# Altium project _OM-O2S Dev.Board.PrjPCB
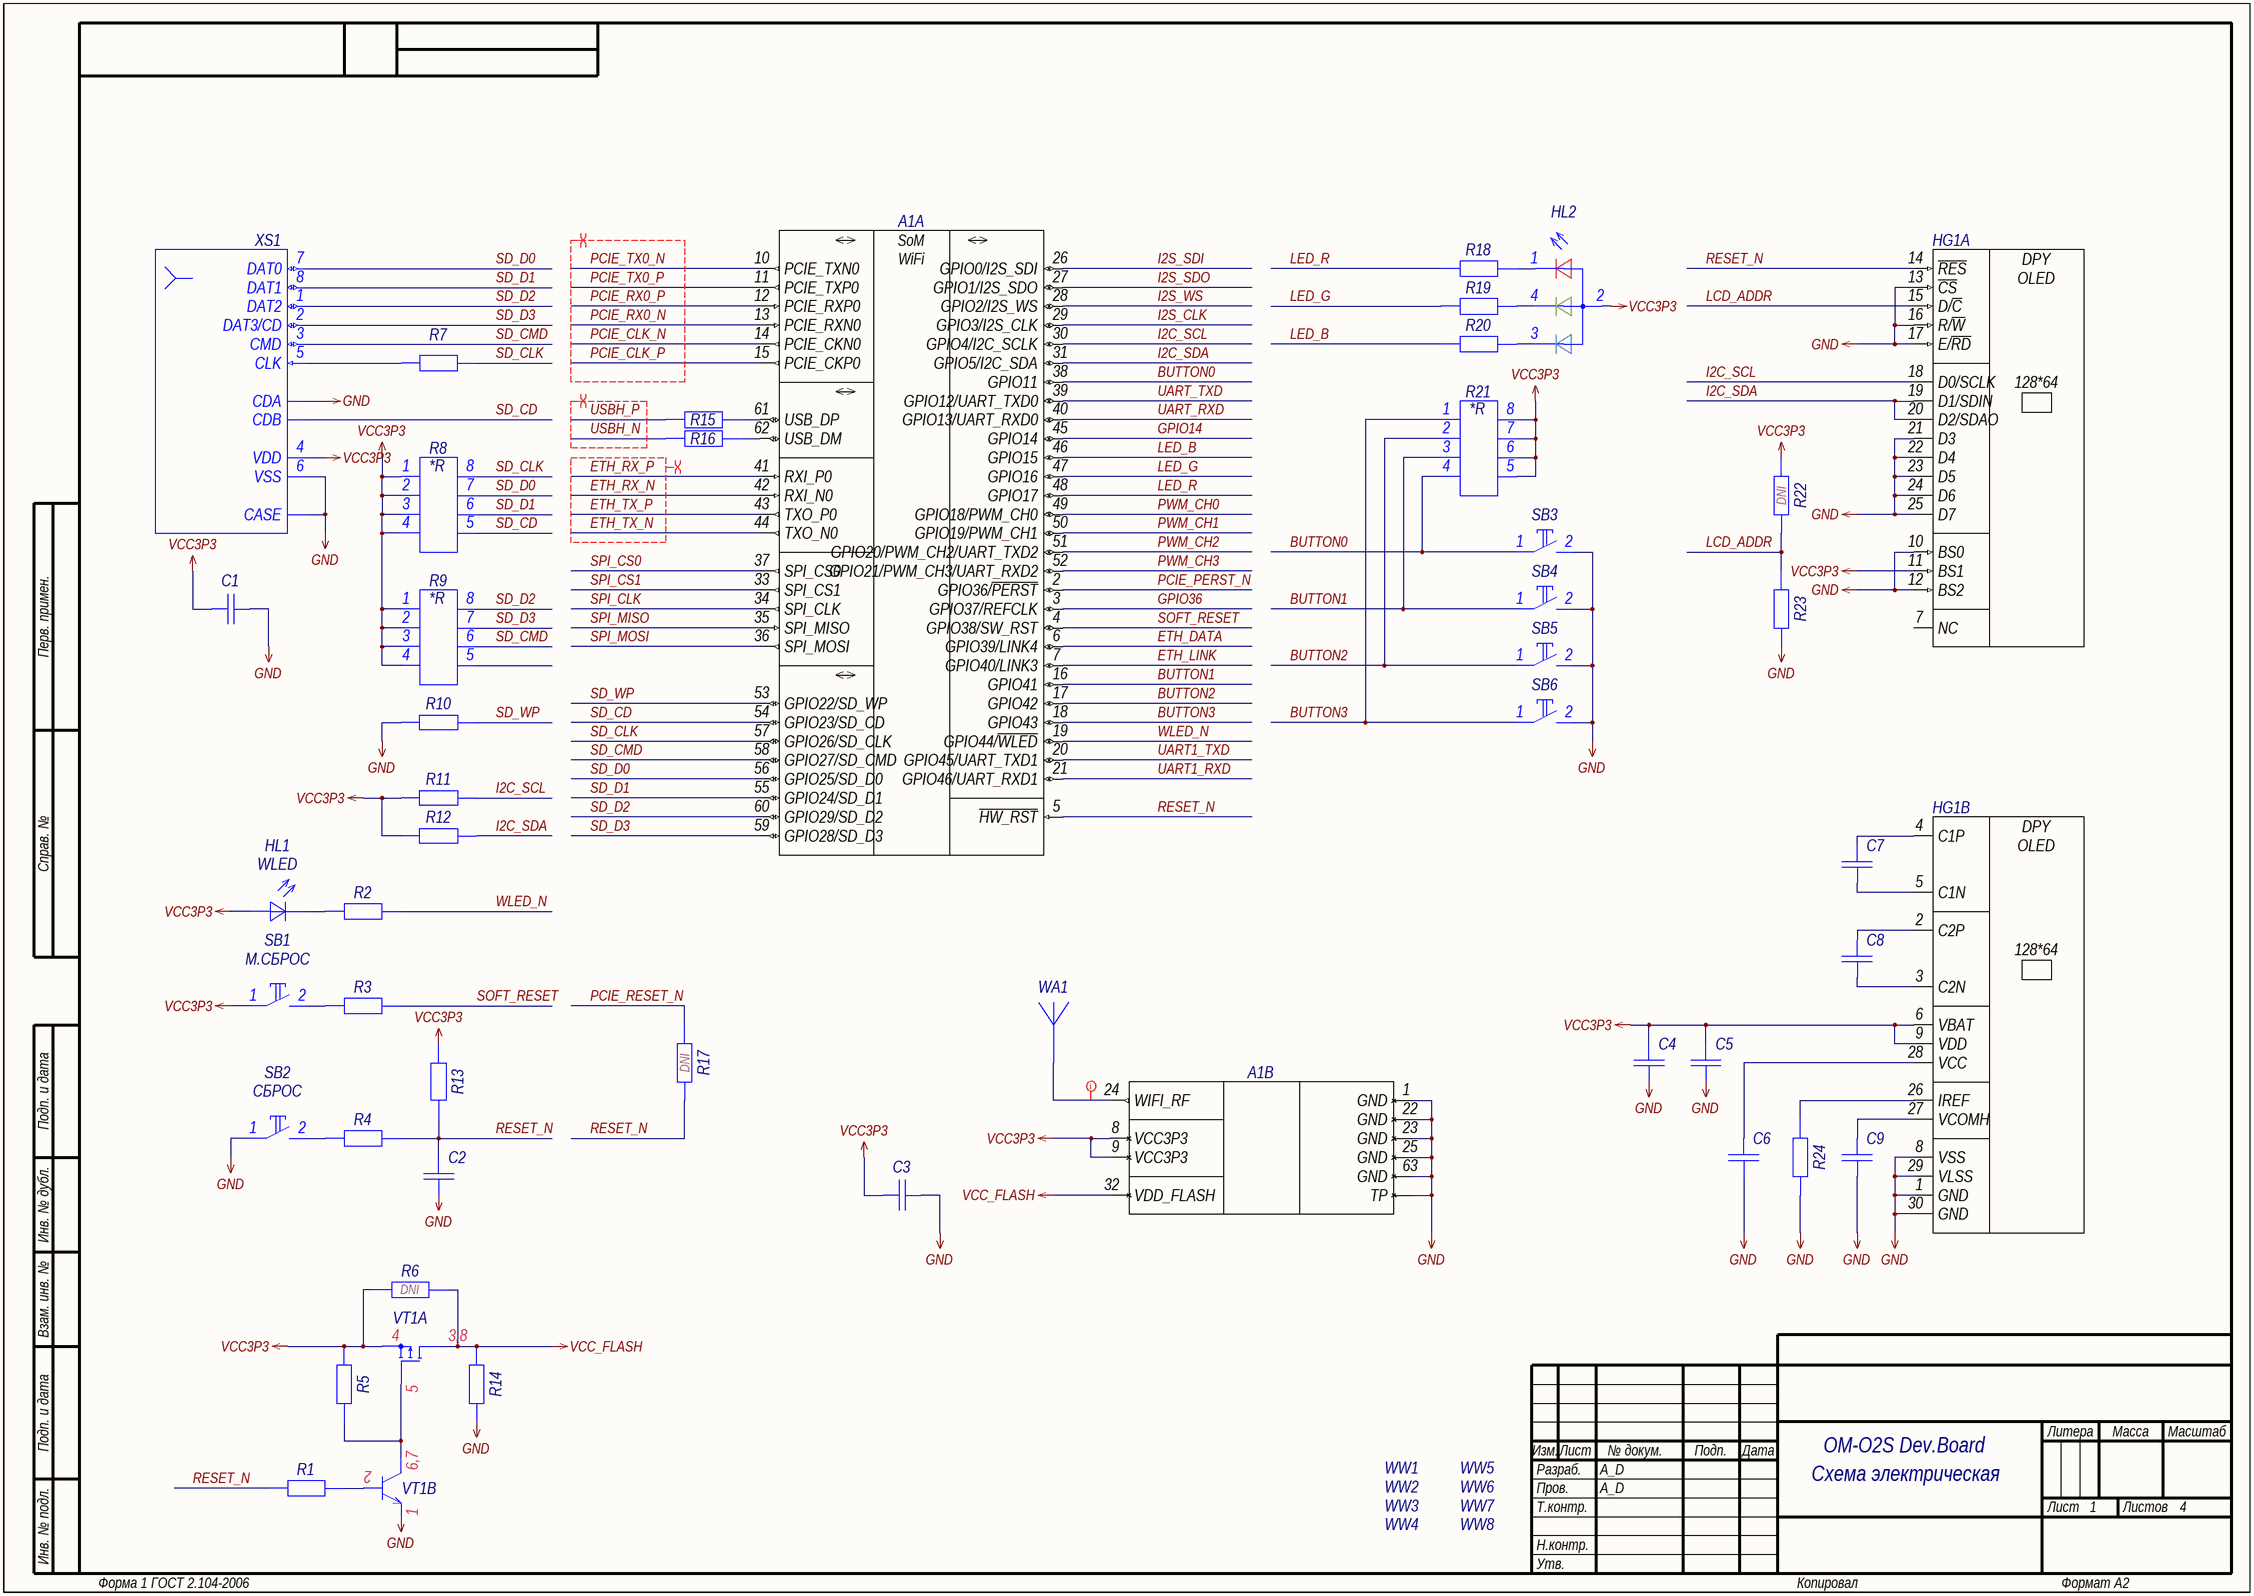
[diagram p0: 01_MAIN.SchDoc]
GlobalOrganizationName: A_D Electronics; GlobalProjectName: OM-O2S Dev.Board; GlobalProjectNumber: A_D.000000.001; GlobalProjectRevision: 1; PCB_ID: NA
4 sheets, 157 parts. Net scope: global (net labels, ports and power ports of the same name join across sheets).
Board file: BOARD.PcbDoc
Sheets:
  01_MAIN.SchDoc
  02_PCIE.SchDoc
  03_I2S.SchDoc
  04_Power.SchDoc

## Sheet 01_MAIN.SchDoc: =GlobalProjectName
size 594 x 420 mm; CheckedBy: A_D; Author: A_D; Organization: A_D Electronics; DocumentNumber: A_D.000000.001 Э3; Revision: 1; SheetNumber: 1; SheetTotal: 4; PageSetup: Record=PageOptions|CenterHorizontal=True|CenterVertical=True|PrintScale=0.70|XCorrection=1.00|YCorrection=1.00|PrintKind=2|BorderSize=5000000|LeftOffset=9000|BottomOffset=10100|Orientation=2|PaperLength=11176|PaperWidth=8636|Scale=100|PaperSource=259|PrintQuality=-3|MediaType=1|DitherType=10|PrintScaleMode=1|PaperKind=A3|PaperIndex=8; FirstApplication: A_D.000000.001; DocumentName: OM-O2S Dev.Board

### Parts
A1  OM-O2Sx  [OM-O2Sx]  (value not drawn)  (parts A,B of 2)
C1  Capacitor  [C0603_L]  (value not drawn)
C2  Capacitor  [C0603_L]  (value not drawn)
C3  Capacitor  [C0603_L]  (value not drawn)
C4  Capacitor  [C0603_L]  (value not drawn)
C5  Capacitor  [C0603_L]  (value not drawn)
C6  Capacitor  [C0603_L]  (value not drawn)
C7  Capacitor  [C0603_L]  (value not drawn)
C8  Capacitor  [C0603_L]  (value not drawn)
C9  Capacitor  [C0603_L]  (value not drawn)
HG1  UG-2864HSWEG01  [UG-2864HSWEG01]  (value not drawn)  (parts A,B of 2)
HL1  WLED  [LD0603_L]
HL2  USER LED  [FM-B1515RGBA-HG]  (value not drawn)
R1  Resistor  [R0603_L]  (value not drawn)
R2  Resistor  [R0603_L]  (value not drawn)
R3  Resistor  [R0603_L]  (value not drawn)
R4  Resistor  [R0603_L]  (value not drawn)
R5  Resistor  [R0603_L]  (value not drawn)
R6  Resistor  [R0603_L]  (value not drawn)  (no BOM)
R7  Resistor  [R0603_L]  (value not drawn)
R8  Resistor-4  [CAT16-x4]  (value not drawn)
R9  Resistor-4  [CAT16-x4]  (value not drawn)
R10  Resistor  [R0603_L]  (value not drawn)
R11  Resistor  [R0603_L]  (value not drawn)
R12  Resistor  [R0603_L]  (value not drawn)
R13  Resistor  [R0603_L]  (value not drawn)
R14  Resistor  [R0603_L]  (value not drawn)
R15  Resistor  [R0603_L]  (value not drawn)
R16  Resistor  [R0603_L]  (value not drawn)
R17  Resistor  [R0603_L]  (value not drawn)  (no BOM)
R18  Resistor  [R0603_L]  (value not drawn)
R19  Resistor  [R0603_L]  (value not drawn)
R20  Resistor  [R0603_L]  (value not drawn)
R21  Resistor-4  [CAT16-x4]  (value not drawn)
R22  Resistor  [R0603_L]  (value not drawn)  (no BOM)
R23  Resistor  [R0603_L]  (value not drawn)
R24  Resistor  [R0603_L]  (value not drawn)
SB1  М.СБРОС  [IT-1185AP]
SB2  СБРОС  [IT-1185AP]
SB3  (no value)  [IT-1185AP]
SB4  (no value)  [IT-1185AP]
SB5  (no value)  [IT-1185AP]
SB6  (no value)  [IT-1185AP]
VT1  PMC85XP  [SOT-1118-2M_065P200X200X065_N]  (value not drawn)  (parts A,B of 2)
WA1  Antenna_US_1p  [AN9520]  (value not drawn)
WW1  NoBody  [MH_M2.5]  (value not drawn)  (no BOM)
WW2  NoBody  [MH_M2.5]  (value not drawn)  (no BOM)
WW3  NoBody  [MH_M2.5]  (value not drawn)  (no BOM)
WW4  NoBody  [MH_M2.5]  (value not drawn)  (no BOM)
WW5  NoBody  [MH_M3.0]  (value not drawn)  (no BOM)
WW6  NoBody  [MH_M3.0]  (value not drawn)  (no BOM)
WW7  NoBody  [MH_M3.0]  (value not drawn)  (no BOM)
WW8  NoBody  [MH_M3.0]  (value not drawn)  (no BOM)
XS1  DM3AT-SF-PEJM5  [DM3AT-SF-PEJM5]  (value not drawn)

### Nets
GND: A1.1(GND) A1.22(GND) A1.23(GND) A1.25(GND) A1.63(GND) A1.TP C1.2 C2.1 C3.2 C4.1 C5.1 C6.1 C9.1 HG1.1(GND) HG1.8(VSS) HG1.10(BS0) HG1.12(BS2) HG1.13(~{CS}) HG1.16(R/~{W}) HG1.17(E/~{RD}) HG1.21(D3) HG1.22(D4) HG1.23(D5) HG1.24(D6) HG1.25(D7) HG1.29(VLSS) HG1.30(GND) R10.1 R14.1 R23.1 R24.1 SB2.1 SB3.2 SB4.2 SB5.2 SB6.2 VT1.1(Э) XS1.6(VSS) XS1.CASE XS1.CDA
VCC3P3: A1.8(VCC3P3) A1.9(VCC3P3) C1.1 C3.1 C4.2 C5.2 HG1.6(VBAT) HG1.9(VDD) HG1.11(BS1) HL1.1(А) HL2.2 R5.2 R6.2 R8.1 R8.2 R8.3 R8.4 R9.1 R9.2 R9.3 R9.4 R11.1 R12.1 R13.2 R21.5 R21.6 R21.7 R21.8 R22.2 SB1.1 VT1.4(S) XS1.4(VDD)
VCC_FLASH: A1.32(VDD_FLASH) R6.1 R14.2 VT1.3(D)
BUTTON0: A1.38(GPIO11) R21.4 SB3.1
BUTTON1: A1.16(GPIO41) R21.3 SB4.1
BUTTON2: A1.17(GPIO42) R21.2 SB5.1
BUTTON3: A1.18(GPIO43) R21.1 SB6.1
ETH_DATA: A1.6(GPIO39/LINK4)
ETH_LINK: A1.7(GPIO40/LINK3)
ETH_RX_N: A1.42(RXI_N0)
ETH_RX_P: A1.41(RXI_P0)
ETH_TX_N: A1.44(TXO_N0)
ETH_TX_P: A1.43(TXO_P0)
GPIO14: A1.45(GPIO14)
GPIO36: A1.3(GPIO37/REFCLK)
I2C_SCL: A1.30(GPIO4/I2C_SCLK) HG1.18(D0/SCLK) R11.2
I2C_SDA: A1.31(GPIO5/I2C_SDA) HG1.19(D1/SDIN) HG1.20(D2/SDAO) R12.2
I2S_CLK: A1.29(GPIO3/I2S_CLK)
I2S_SDI: A1.26(GPIO0/I2S_SDI)
I2S_SDO: A1.27(GPIO1/I2S_SDO)
I2S_WS: A1.28(GPIO2/I2S_WS)
LCD_ADDR: HG1.15(D/~{C}) R22.1 R23.2
LED_B: A1.46(GPIO15) R20.1
LED_G: A1.47(GPIO16) R19.1
LED_R: A1.48(GPIO17) R18.1
PCIE_CLK_N: A1.14(PCIE_CKN0)
PCIE_CLK_P: A1.15(PCIE_CKP0)
PCIE_PERST_N: A1.2(GPIO36/~{PERST})
PCIE_RESET_N: R17.1
PCIE_RX0_N: A1.13(PCIE_RXN0)
PCIE_RX0_P: A1.12(PCIE_RXP0)
PCIE_TX0_N: A1.10(PCIE_TXN0)
PCIE_TX0_P: A1.11(PCIE_TXP0)
PWM_CH0: A1.49(GPIO18/PWM_CH0)
PWM_CH1: A1.50(GPIO19/PWM_CH1)
PWM_CH2: A1.51(GPIO20/PWM_CH2/UART_TXD2)
PWM_CH3: A1.52(GPIO21/PWM_CH3/UART_RXD2)
RESET_N: A1.5(~{HW_RST}) C2.2 HG1.14(~{RES}) R1.1 R4.2 R13.1 R17.2
SD_CD: A1.54(GPIO23/SD_CD) R8.5 XS1.CDB
SD_CLK: A1.57(GPIO26/SD_CLK) R7.2 R8.8
SD_CMD: A1.58(GPIO27/SD_CMD) R9.6 XS1.3(CMD)
SD_D0: A1.56(GPIO25/SD_D0) R8.7 XS1.7(DAT0)
SD_D1: A1.55(GPIO24/SD_D1) R8.6 XS1.8(DAT1)
SD_D2: A1.60(GPIO29/SD_D2) R9.8 XS1.1(DAT2)
SD_D3: A1.59(GPIO28/SD_D3) R9.7 XS1.2(DAT3/CD)
SD_WP: A1.53(GPIO22/SD_WP) R10.2
SOFT_RESET: A1.4(GPIO38/SW_RST) R3.2
SPI_CLK: A1.34(SPI_CLK)
SPI_CS0: A1.37(SPI_CS0)
SPI_CS1: A1.33(SPI_CS1)
SPI_MISO: A1.35(SPI_MISO)
SPI_MOSI: A1.36(SPI_MOSI)
UART1_RXD: A1.21(GPIO46/UART_RXD1)
UART1_TXD: A1.20(GPIO45/UART_TXD1)
UART_RXD: A1.40(GPIO13/UART_RXD0)
UART_TXD: A1.39(GPIO12/UART_TXD0)
USBH_N: R16.1
USBH_P: R15.1
WLED_N: A1.19(GPIO44/~{WLED}) R2.2
NetA1_24: A1.24(WIFI_RF) WA1.1
NetA1_61: A1.61(USB_DP) R15.2
NetA1_62: A1.62(USB_DM) R16.2
NetC6_2: C6.2 HG1.28(VCC)
NetC7_1: C7.1 HG1.5(C1N)
NetC7_2: C7.2 HG1.4(C1P)
NetC8_1: C8.1 HG1.3(C2N)
NetC8_2: C8.2 HG1.2(C2P)
NetC9_2: C9.2 HG1.27(VCOMH)
NetHG1_26: HG1.26(IREF) R24.2
NetHL1_2: HL1.2(К) R2.1
NetHL2_1: HL2.1 R18.2
NetHL2_3: HL2.3 R20.2
NetHL2_4: HL2.4 R19.2
NetR1_2: R1.2 VT1.2(Б)
NetR3_1: R3.1 SB1.2
NetR4_1: R4.1 SB2.2
NetR5_1: R5.1 VT1.5(G) VT1.6(К)
NetR7_1: R7.1 XS1.5(CLK)

Not connected (* = marked no-connect by the designer): HG1 7(NC); R9 5

### Layout directives
net class RF; rule Clearance Constraint [Clearance = 0.3mm]: NetA1_24
differential pair; differential pair class PCIE_DiffPair; rule Matched Net Lengths [Tolerance = 1mm]: PCIE_CLK_N, PCIE_CLK_P, PCIE_RX0_N, PCIE_RX0_P, PCIE_TX0_N, PCIE_TX0_P
differential pair; differential pair class USB_DiffPair; rule Matched Net Lengths [Tolerance = 1mm]: USBH_N, USBH_P
differential pair; differential pair class ETH_DiffPair; rule Matched Net Lengths [Tolerance = 1mm]: ETH_RX_N, ETH_RX_P, ETH_TX_N, ETH_TX_P

### Notes on the sheet
- (near R22) DNI
- (near R17) DNI
- (near R6) DNI
- Схема электрическая
  принципиальная
- Перв. примен.
- Справ. №
- Подп. и дата
- Инв. № дубл.
- Взам. инв. №
- Разраб.
- Изм.
- Лист
- № докум.
- Подп.
- Дата
- Литера
- Масса
- Масштаб
- Пров.
- Т.контр.
- Листов
- Инв. № подл.
- Н.контр.
- Утв.
- Форма 1 ГОСТ 2.104-2006
- Копировал
- Формат А2
- (in symbol CAT16-103J4LF) *R
- (in symbol OM-O2SP, part A) SoM; WiFi
- (in symbol PMC85XP, part A) 3,8
- (in symbol PMC85XP, part B) 6,7
- (in symbol UG-2864HSWEG01, part A) DPY
- (in symbol UG-2864HSWEG01, part B) DPY

### Library data of the parts
A1 = OM-O2SP: Manufacturer: Onion; ID: 1; Supply Operation: +2.97...3.63V; Supply Current: 400mA; ROM/RAM: 32MB/128MB; Wireless Compatibility: Wi-Fi; Supported Interfaces: GPIO, I2C, I2S, SPI, UART, USB; I/O Lines: 42; Operation Frequency: 580MHz; Working Temperature Min: -10°С; Working Temperature Max: +55°С; Functional Analog: OM-O2S; Published: 06.03.2019; Publisher: Andrew Danich; Type: Модуль; Part Number: OM-O2SP; Value: OM-O2SP; Application Category: 1
C1 C3 = GRM188R61A106KE69D: Manufacturer: Murata; Type: Конденсатор; ID: 173; Value: 10uF; Voltage: 10V; Tolerance: ±10%; Dielectric Type: X5R; Application Category: 1; Working Temperature Min: -55°С; Working Temperature Max: +85°С; Published: 18.05.2010; Publisher: Andrew Danich; Part Number: GRM188R61A106KE69D; Footprint: 0603
C2 = GRM188R72A104KA35D: Manufacturer: Murata; Type: Конденсатор; ID: 232; Value: 0.1uF; Voltage: 100V; Tolerance: ±10%; Dielectric Type: X7R; Application Category: 1; Working Temperature Min: -55°С; Working Temperature Max: +125°С; Published: 18.05.2010; Publisher: Andrew Danich; Part Number: GRM188R72A104KA35D; Footprint: 0603
C4 C5 C7 C8 = GCM188R71E105KA64D: Manufacturer: Murata; Type: Конденсатор; ID: 134; Value: 1uF; Voltage: 25V; Tolerance: ±10%; Dielectric Type: X7R; Application Category: 1; Working Temperature Min: -55°С; Working Temperature Max: +85°С; Published: 18.05.2010; Publisher: Andrew Danich; Part Number: GCM188R71E105KA64D; Footprint: 0603
C6 = GRM188R61E225MA12D: Manufacturer: Murata; Type: Конденсатор; ID: 152; Value: 2.2uF; Voltage: 25V; Tolerance: ±20%; Dielectric Type: X5R; Application Category: 1; Working Temperature Min: -55°С; Working Temperature Max: +85°С; Published: 18.05.2010; Publisher: Andrew Danich; Part Number: GRM188R61E225MA12D; Footprint: 0603
C9 = GRT188C81E475KE13D: Manufacturer: Murata; Type: Конденсатор; ID: 175; Value: 4.7uF; Voltage: 25V; Tolerance: ±20%; Dielectric Type: X6S; Application Category: 1; Working Temperature Min: -55°С; Working Temperature Max: +105°С; Published: 18.05.2010; Publisher: Andrew Danich; Part Number: GRT188C81E475KE13D; Footprint: 0603
HG1 = UG-2864HSWEG01: Manufacturer: WiseChip Semiconductor; ID: 1; Supply Operation: +1.65…3.3V; Supply Current: 28.9mA; Resolution - Pixels: 128*64; Diagonal: 0.96; Touch Panel: No; Display Type: OLED; Working Temperature Min: -30°С; Working Temperature Max: +70°С; Published: 13.03.2019; Publisher: Andrew Danich; Type: Индикатор графический; Part Number: UG-2864HSWEG01; Value: UG-2864HSWEG01; Application Category: 1
HL1 = BL-LS0603DNB: Type: Индикатор единичный; ID: 12; Forward Voltage: 3.5V; Forward Current: 30mA; Power Dissipation: 78mW; Color: Blue; Leds: 1; Published: 03.12.2013; Publisher: Andrew Danich; Part Number: BL-LS0603DNB; Value: BL-LS0603DNB; Footprint: 0603; Application Category: 1
HL2 = FM-B1515RGBA-HG: Manufacturer: Foshan NationStar Optoelectronics; Type: Сборка индикаторная; ID: 36; Forward Voltage: 2.4/3.4/3.4V; Forward Current: 50/40/40mA; Power Dissipation: 48/68/68mW; Color: Red, Green, Blue; Leds: 3; Application Category: 1; Working Temperature Min: -30°С; Working Temperature Max: +85°С; Published: 17.03.2019; Publisher: Andrew Danich; Part Number: FM-B1515RGBA-HG; Value: FM-B1515RGBA-HG
R1 = RC0603JR-0722KL: Manufacturer: Yageo; ID: 32; Value: 22k; Limit Voltage: 50V; Tolerance: ±5%; Temperature Coefficient: 100ppm; Total Power Dissipation: 0.1W; Series Type: Thick-Film; Application Category: 1; Working Temperature Min: -55°С; Working Temperature Max: +155°С; Published: 24.03.2010; Publisher: Andrew Danich; Type: Резистор; Part Number: RC0603JR-0722KL; Footprint: 0603
R2 = RC0603JR-071KL: Manufacturer: Yageo; ID: 19; Value: 1k; Limit Voltage: 50V; Tolerance: ±5%; Temperature Coefficient: 100ppm; Total Power Dissipation: 0.1W; Series Type: Thick-Film; Application Category: 1; Working Temperature Min: -55°С; Working Temperature Max: +155°С; Functional Analog: CR0603-JW-102E; Published: 24.03.2010; Publisher: Andrew Danich; Type: Резистор; Part Number: RC0603JR-071KL; Footprint: 0603
R3 R14 = RC0603JR-073KL: Manufacturer: Yageo; ID: 52; Value: 3k; Limit Voltage: 50V; Tolerance: ±5%; Temperature Coefficient: 100ppm; Total Power Dissipation: 0.1W; Series Type: Thick-Film; Application Category: 1; Working Temperature Min: -55°С; Working Temperature Max: +155°С; Published: 24.03.2010; Publisher: Andrew Danich; Type: Резистор; Part Number: RC0603JR-073KL; Footprint: 0603
R4 R18-R20 = RC0603JR-07100R: Manufacturer: Yageo; ID: 10; Value: 100; Limit Voltage: 50V; Tolerance: ±5%; Temperature Coefficient: 100ppm; Total Power Dissipation: 0.1W; Series Type: Thick-Film; Application Category: 1; Working Temperature Min: -55°С; Working Temperature Max: +155°С; Functional Analog: CR0603-JW-101E; Published: 24.03.2010; Publisher: Andrew Danich; Type: Резистор; Part Number: RC0603JR-07100R; Footprint: 0603
R5 = RC0603JR-0710KL: Manufacturer: Yageo; ID: 12; Value: 10k; Limit Voltage: 50V; Tolerance: ±5%; Temperature Coefficient: 100ppm; Total Power Dissipation: 0.1W; Series Type: Thick-Film; Application Category: 1; Working Temperature Min: -55°С; Working Temperature Max: +155°С; Functional Analog: CR0603-JW-103E; Published: 24.03.2010; Publisher: Andrew Danich; Type: Резистор; Part Number: RC0603JR-0710KL; Footprint: 0603
R6 R17 R22 R23 = RC0603JR-070R: Manufacturer: Yageo; ID: 5; Value: 0; Limit Voltage: 50V; Tolerance: ±5%; Temperature Coefficient: 100ppm; Total Power Dissipation: 0.1W; Series Type: Thick-Film; Application Category: 1; Working Temperature Min: -55°С; Working Temperature Max: +155°С; Functional Analog: RC0603FR-070RL, CR0603-J/-000E; Published: 24.03.2010; Publisher: Andrew Danich; Type: Резистор; Part Number: RC0603JR-070R; Footprint: 0603
R7 = RC0603JR-0730RL: Manufacturer: Yageo; ID: 412; Value: 30; Limit Voltage: 50V; Tolerance: ±5%; Temperature Coefficient: 100ppm; Total Power Dissipation: 0.1W; Series Type: Thick-Film; Application Category: 1; Working Temperature Min: -55°С; Working Temperature Max: +155°С; Published: 24.03.2010; Publisher: Andrew Danich; Type: Резистор; Part Number: RC0603JR-0730RL; Footprint: 0603
R8 R9 R21 = CAT16-103J4LF: Manufacturer: Bourns; ID: 232; Value: 10k; Limit Voltage: 50V; Tolerance: ±5%; Temperature Coefficient: 200ppm; Total Power Dissipation: 0,062W; Series Type: Thick-Film; Application Category: 1; Working Temperature Min: -55°С; Working Temperature Max: +125°С; Functional Analog: TC164-JR-0710KL; Published: 15.07.2014; Publisher: Andrew Danich; Type: Набор резисторов; Part Number: CAT16-103J4LF
R10-R13 = RC0603JR-074K7L: Manufacturer: Yageo; ID: 56; Value: 4.7k; Limit Voltage: 50V; Tolerance: ±5%; Temperature Coefficient: 100ppm; Total Power Dissipation: 0.1W; Series Type: Thick-Film; Application Category: 1; Working Temperature Min: -55°С; Working Temperature Max: +155°С; Published: 24.03.2010; Publisher: Andrew Danich; Type: Резистор; Part Number: RC0603JR-074K7L; Footprint: 0603
R15 R16 = RC0603JR-0722RL: Manufacturer: Yageo; ID: 29; Value: 22; Limit Voltage: 50V; Tolerance: ±5%; Temperature Coefficient: 100ppm; Total Power Dissipation: 0.1W; Series Type: Thick-Film; Application Category: 1; Working Temperature Min: -55°С; Working Temperature Max: +155°С; Published: 24.03.2010; Publisher: Andrew Danich; Type: Резистор; Part Number: RC0603JR-0722RL; Footprint: 0603
R24 = RC0603JR-07910KL: Manufacturer: Yageo; ID: 88; Value: 910k; Limit Voltage: 50V; Tolerance: ±5%; Temperature Coefficient: 100ppm; Total Power Dissipation: 0.1W; Series Type: Thick-Film; Application Category: 1; Working Temperature Min: -55°С; Working Temperature Max: +155°С; Published: 24.03.2010; Publisher: Andrew Danich; Type: Резистор; Part Number: RC0603JR-07910KL; Footprint: 0603
SB1-SB6 = IT-1185AP: ID: 36; Limit Current: 50mA; Resistance: 0.1ohm; Isolator Resistance: 100meg; Backlight: NO; Number of Contacts: 2; Application Category: 1; Published: 17.04.2014; Publisher: Andrew Danich; Type: Переключатель; Part Number: IT-1185AP; Value: IT-1185AP; Height: 5mm
VT1 = PMC85XP: Manufacturer: NXP Semiconductors; Type: Сборка транзисторная; ID: 33; D-S Voltage: -30V; Drain Current: -3.4A; D-S On-Resistance: 110momh; Gate Capacitance: 680pF; Total Power Dissipation: 1.17W; Gate Threshold Voltage: -1.2V; Application Category: 1; Working Temperature Min: -55°С; Working Temperature Max: +150°С; Published: 13.03.2017; Publisher: Andrew Danich; Part Number: PMC85XP; Value: PMC85XP; Functional Analog: -
WA1 = AN9520: Manufacturer: RainSun; ID: 1; Value: AN9520; Center Frequency: 2.45GHz; Peak Gain: 1.5dBi; VSWR: 2.0; Input Impedance: 50ohm; Power Handling: 3W; Azimuth Beamwidth: Omni‐directional; Bandwidth: Linear; Working Temperature Min: -40°С; Working Temperature Max: +85°С; Published: 15.01.2015; Type: Антенна; Publisher: Andrew Danich; Part Number: AN9520; Application Category: 1
WW1-WW8 = MOUNTINGHOLE: ID: 1; Published: 24.03.2015; Publisher: Andrew Danich; Type: Лепесток; Part Number: MOUNTINGHOLE; Value: MOUNTINGHOLE
XS1 = DM3AT-SF-PEJM5: Manufacturer: Hirose Connector; ID: 5; Limit Voltage: 125V; Style: Push-Push; Connector Type: microSD Card; Interface: SPI\SDIO; Pitch: 1.1mm; Application Category: 1; Working Temperature Min: -25°С; Working Temperature Max: +85°С; Value: DM3AT-SF-PEJM5; Published: 14.03.2019; Publisher: Andrew Danich; Type: Розетка; Part Number: DM3AT-SF-PEJM5; Pins: 10

## Sheet 02_PCIE.SchDoc: =GlobalProjectName
size 594 x 420 mm; CheckedBy: A_D; Author: A_D; Organization: A_D Electronics; DocumentNumber: A_D.000000.001 Э3; Revision: 1; SheetNumber: 2; SheetTotal: 4; PageSetup: Record=PageOptions|CenterHorizontal=True|CenterVertical=True|PrintScale=0.70|XCorrection=1.00|YCorrection=1.00|PrintKind=2|BorderSize=5000000|LeftOffset=9000|BottomOffset=10100|Orientation=2|PaperLength=11176|PaperWidth=8636|Scale=100|PaperSource=259|PrintQuality=-3|MediaType=1|DitherType=10|PrintScaleMode=1|PaperKind=A3|PaperIndex=8; FirstApplication: A_D.000000.001; DocumentName: OM-O2S Dev.Board
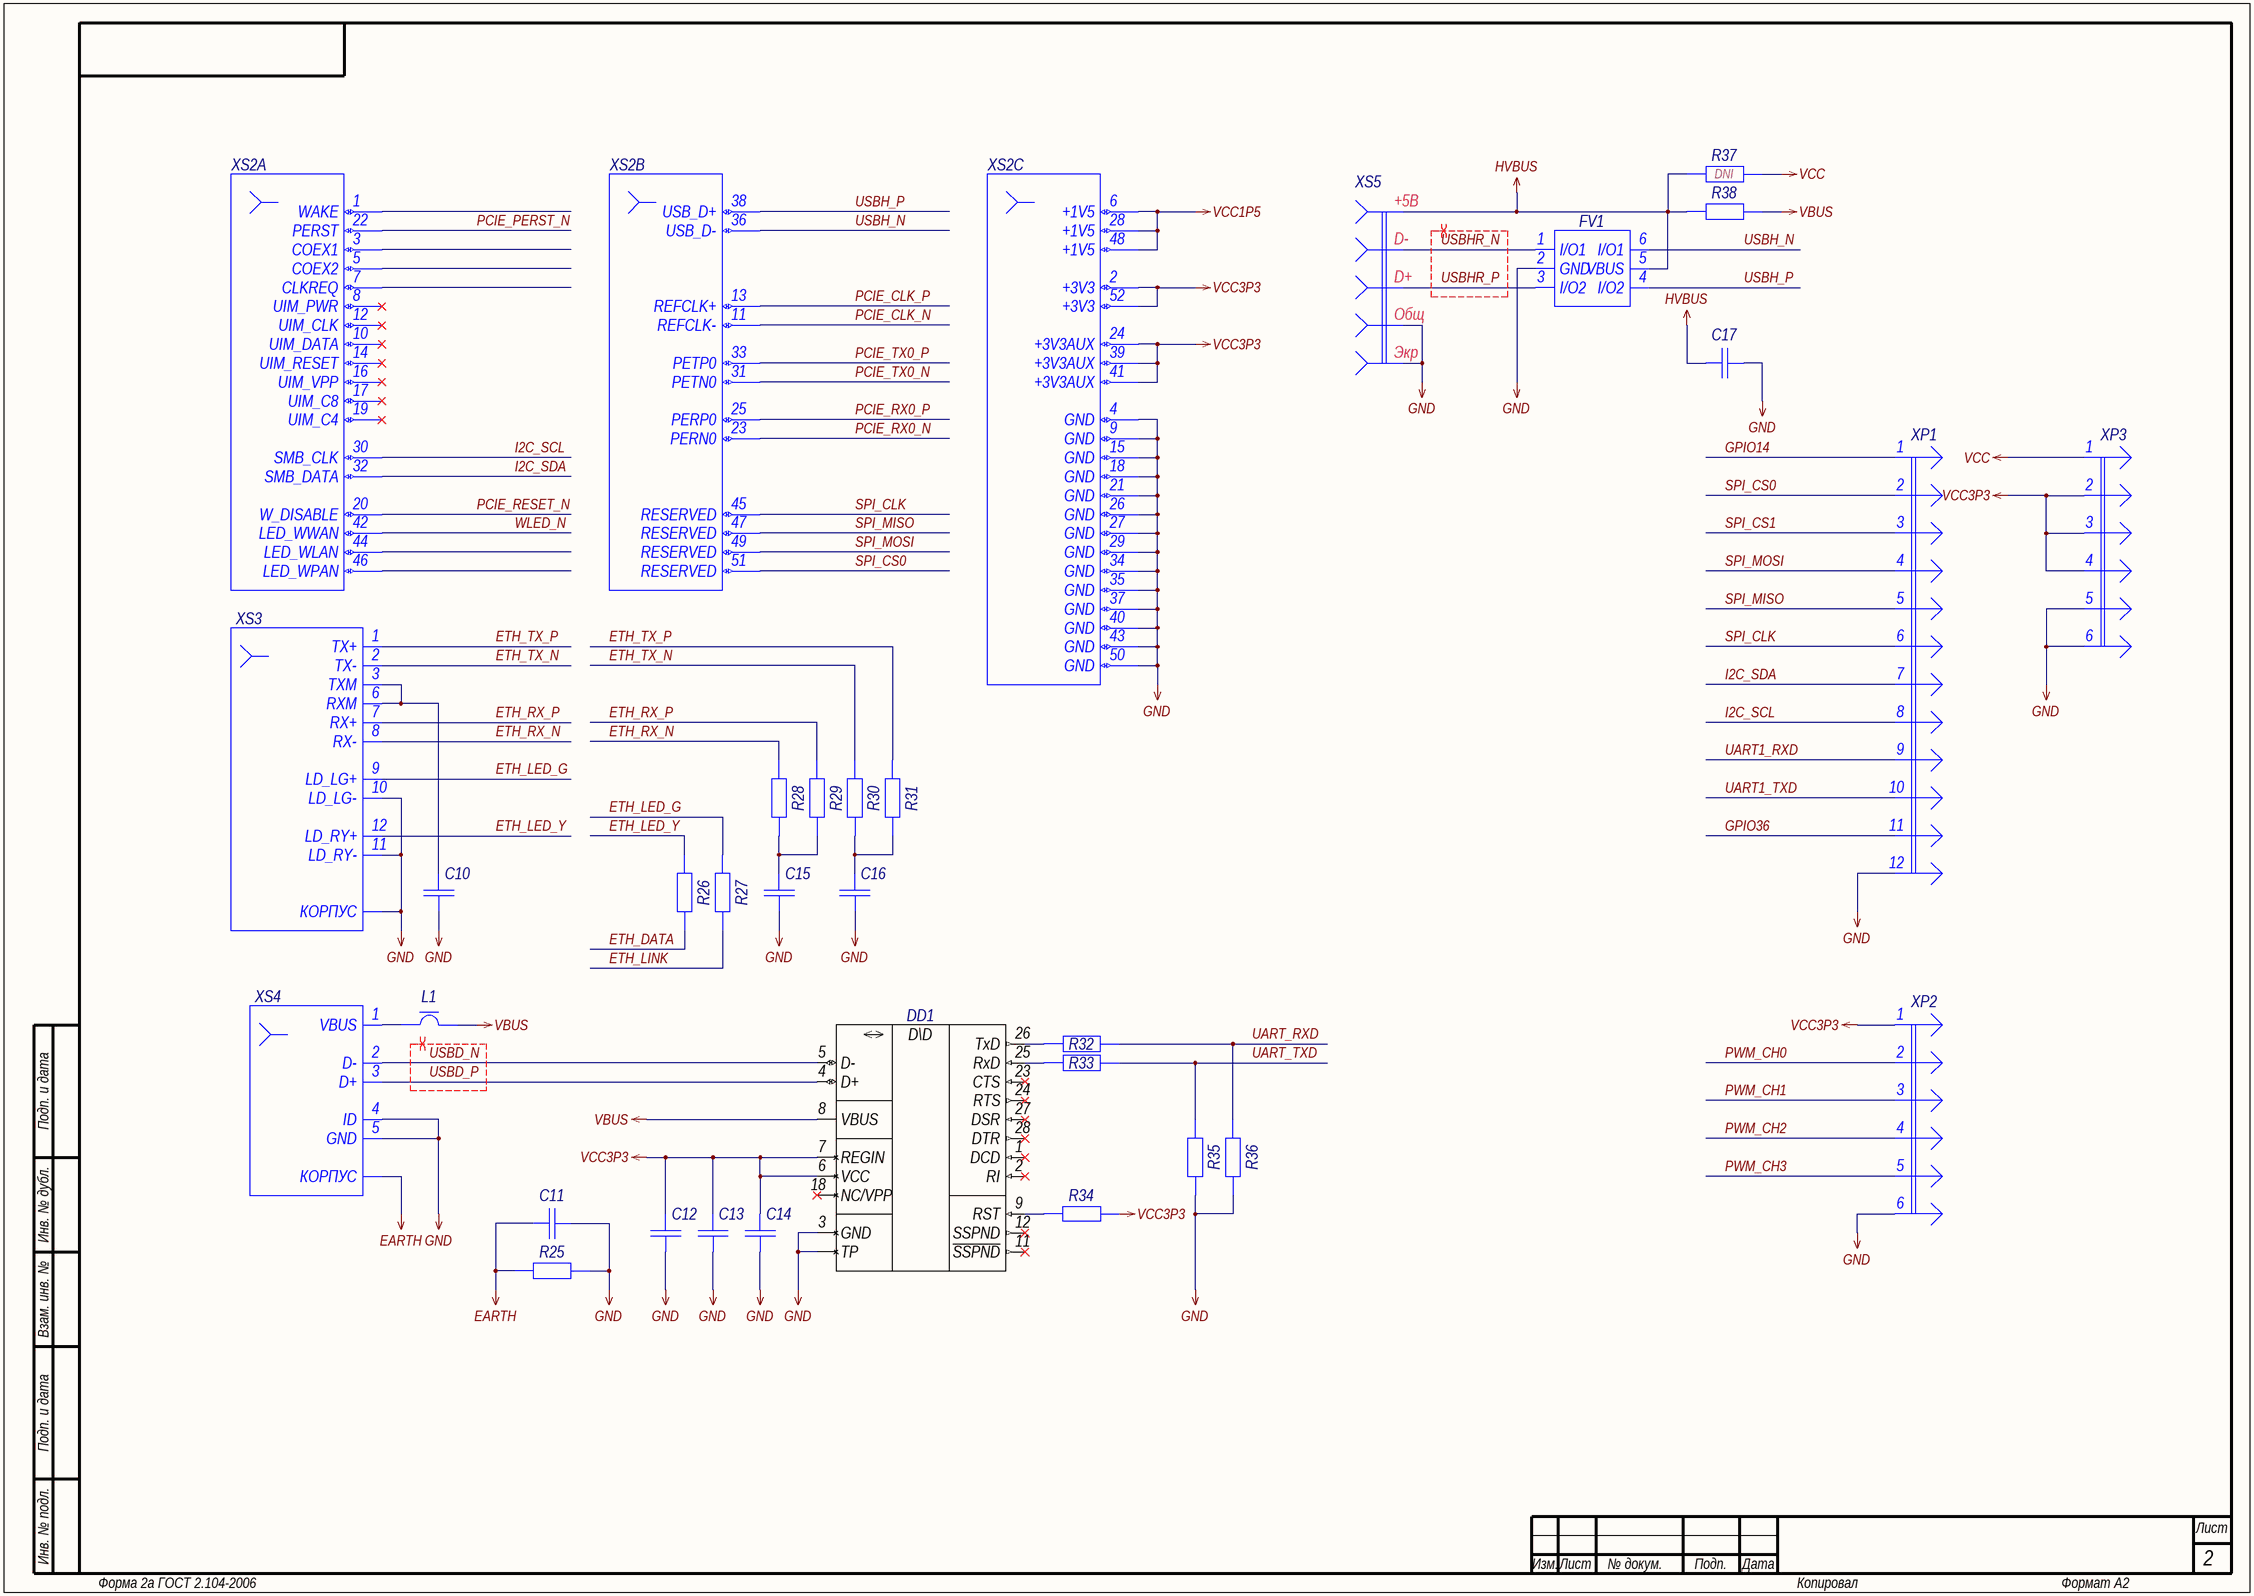
[diagram p1: 02_PCIE.SchDoc]

### Parts
C10  Capacitor  [C0603_L]  (value not drawn)
C11  Capacitor  [C0603_L]  (value not drawn)
C12  Capacitor  [C0603_L]  (value not drawn)
C13  Capacitor  [C0603_L]  (value not drawn)
C14  Capacitor  [C0603_L]  (value not drawn)
C15  Capacitor  [C0603_L]  (value not drawn)
C16  Capacitor  [C0603_L]  (value not drawn)
C17  Capacitor  [C0603_L]  (value not drawn)
DD1  CP2102_9  [QFN-28_050P500X500X100_N]  (value not drawn)
FV1  USBLC6-2SC6  [SOT-23-6_095P290X160X145_N]  (value not drawn)
L1  FerriteBead  [L0805_L]  (value not drawn)
R25  Resistor  [R0603_L]  (value not drawn)
R26  Resistor  [R0603_L]  (value not drawn)
R27  Resistor  [R0603_L]  (value not drawn)
R28  Resistor  [R0603_L]  (value not drawn)
R29  Resistor  [R0603_L]  (value not drawn)
R30  Resistor  [R0603_L]  (value not drawn)
R31  Resistor  [R0603_L]  (value not drawn)
R32  Resistor  [R0603_L]  (value not drawn)
R33  Resistor  [R0603_L]  (value not drawn)
R34  Resistor  [R0603_L]  (value not drawn)
R35  Resistor  [R0603_L]  (value not drawn)
R36  Resistor  [R0603_L]  (value not drawn)
R37  Resistor  [R0603_L]  (value not drawn)  (no BOM)
R38  Resistor  [R0603_L]  (value not drawn)
XP1  IO  [PLS-12]  (value not drawn)
XP2  POWER  [PLS-6]  (value not drawn)
XP3  POWER  [PLS-6]  (value not drawn)
XS2  Text  [2041119-2]  (value not drawn)  (parts A,B,C of 3)  (no BOM)
XS3  ETH  [SK02-111006NL]  (value not drawn)
XS4  Text  [A01SB141B1-067]  (value not drawn)
XS5  Text  [DS1095]  (value not drawn)

### Nets
EARTH: C11.2 R25.1 XS4.SHELL(КОРПУС)
GND: C10.1 C11.1 C12.1 C13.1 C14.1 C15.1 C16.1 C17.2 DD1.3(GND) DD1.TP FV1.2(GND) R25.2 R35.1 R36.1 XP1.12 XP2.6 XP3.5 XP3.6 XS2.4(GND) XS2.9(GND) XS2.15(GND) XS2.18(GND) XS2.21(GND) XS2.26(GND) XS2.27(GND) XS2.29(GND) XS2.34(GND) XS2.35(GND) XS2.37(GND) XS2.40(GND) XS2.43(GND) XS2.50(GND) XS3.10(LD_LG-) XS3.11(LD_RY-) XS3.CASE(КОРПУС) XS4.4(ID) XS4.5(GND) XS5.4 XS5.5
HVBUS: C17.1 FV1.5(VBUS) R37.1 R38.1 XS5.1
VBUS: DD1.8(VBUS) L1.2 R38.2
VCC: R37.2 XP3.1
VCC1P5: XS2.6(+1V5) XS2.28(+1V5) XS2.48(+1V5)
VCC3P3: C12.2 C13.2 C14.2 DD1.6(VCC) DD1.7(REGIN) R34.1 XP2.1 XP3.2 XP3.3 XP3.4 XS2.2(+3V3) XS2.24(+3V3AUX) XS2.39(+3V3AUX) XS2.41(+3V3AUX) XS2.52(+3V3)
ETH_DATA: R26.1
ETH_LED_G: R27.2 XS3.9(LD_LG+)
ETH_LED_Y: R26.2 XS3.12(LD_RY+)
ETH_LINK: R27.1
ETH_RX_N: R28.2 XS3.8(RX-)
ETH_RX_P: R29.2 XS3.7(RX+)
ETH_TX_N: R30.2 XS3.2(TX-)
ETH_TX_P: R31.2 XS3.1(TX+)
GPIO14: XP1.1
GPIO36: XP1.11
I2C_SCL: XP1.8 XS2.30(SMB_CLK)
I2C_SDA: XP1.7 XS2.32(SMB_DATA)
PCIE_CLK_N: XS2.11(REFCLK-)
PCIE_CLK_P: XS2.13(REFCLK+)
PCIE_PERST_N: XS2.22(PERST)
PCIE_RESET_N: XS2.20(W_DISABLE)
PCIE_RX0_N: XS2.23(PERN0)
PCIE_RX0_P: XS2.25(PERP0)
PCIE_TX0_N: XS2.31(PETN0)
PCIE_TX0_P: XS2.33(PETP0)
PWM_CH0: XP2.2
PWM_CH1: XP2.3
PWM_CH2: XP2.4
PWM_CH3: XP2.5
SPI_CLK: XP1.6 XS2.45(RESERVED)
SPI_CS0: XP1.2 XS2.51(RESERVED)
SPI_CS1: XP1.3
SPI_MISO: XP1.5 XS2.47(RESERVED)
SPI_MOSI: XP1.4 XS2.49(RESERVED)
UART1_RXD: XP1.9
UART1_TXD: XP1.10
UART_RXD: R32.2 R36.2
UART_TXD: R33.2 R35.2
USBD_N: DD1.5(D-) XS4.2(D-)
USBD_P: DD1.4(D+) XS4.3(D+)
USBH_N: FV1.6(I/O1) XS2.36(USB_D-)
USBH_P: FV1.4(I/O2) XS2.38(USB_D+)
USBHR_N: FV1.1(I/O1) XS5.2
USBHR_P: FV1.3(I/O2) XS5.3
WLED_N: XS2.42(LED_WWAN)
NetC10_2: C10.2 XS3.3(TXM) XS3.6(RXM)
NetC15_2: C15.2 R28.1 R29.1
NetC16_2: C16.2 R30.1 R31.1
NetDD1_9: DD1.9(RST) R34.2
NetDD1_25: DD1.25(RxD) R33.1
NetDD1_26: DD1.26(TxD) R32.1
NetL1_1: L1.1 XS4.1(VBUS)

Not connected (* = marked no-connect by the designer): DD1 1(DCD)* 2(RI)* 11(~{SSPND})* 12(SSPND)* 18(NC/VPP)* 23(CTS)* 24(RTS)* 27(DSR)* 28(DTR)*; XS2 1(WAKE) 3(COEX1) 5(COEX2) 7(CLKREQ) 8(UIM_PWR)* 10(UIM_DATA)* 12(UIM_CLK)* 14(UIM_RESET)* 16(UIM_VPP)* 17(UIM_C8)* 19(UIM_C4)* 44(LED_WLAN) 46(LED_WPAN)

### Layout directives
differential pair; differential pair class USB_DiffPair; rule Matched Net Lengths [Tolerance = 1mm]: USBD_N, USBD_P, USBHR_N, USBHR_P

### Notes on the sheet
- (near R37) DNI
- Подп. и дата
- Инв. № дубл.
- Взам. инв. №
- Инв. № подл.
- Изм.
- Лист
- № докум.
- Подп.
- Дата
- Форма 2а ГОСТ 2.104-2006
- Копировал
- Формат А2
- (in symbol CP2102-GM) D\D
- (in symbol DS1095-B-R) +5В; D-; D+; Общ; Экр

### Library data of the parts
C10 C11 C13-C16 = GRM188R72A104KA35D: as C2 on sheet 01_MAIN; Published: 18.05.2010; Publisher: Andrew Danich; Part Number: GRM188R72A104KA35D; Footprint: 0603
  C11: ClassName: DirectConnect
C12 = GCM188R71E105KA64D: as C4 on sheet 01_MAIN; Published: 18.05.2010; Publisher: Andrew Danich; Part Number: GCM188R71E105KA64D; Footprint: 0603
C17 = GRM188R61A106KE69D: as C1 on sheet 01_MAIN; Published: 18.05.2010; Publisher: Andrew Danich; Part Number: GRM188R61A106KE69D; Footprint: 0603
DD1 = CP2102-GM: Single Chip USB to UART Bridge; Manufacturer: Silicon Labs; ID: 4; Supply Operation: +3.3V; Supply Current: 13.7mA; USB Type Support: USB 2.0; USB Speed Support: 12 Mb/s; OTG Support: No; Channels: 1; Working Temperature Min: -40°C; Working Temperature Max: +85°C; Published: 03.08.2015; Publisher: Andrew Danich; Type: Микросхема; Part Number: CP2102-GM; Value: CP2102-GM; Input Interface: UART; Application Category: 1; Functional Analog: -
FV1 = USBLC6-2SC6: Manufacturer: STMicroelectronics; ID: 11; Breakdown Voltage: 6V; Reverse Stand Off Voltage: 17V; Forward Voltage: 0.95V; Peak Forward Current: 5A; Junction Capacitance: 2.5pF; Directional: Bidirectional; Application Category: 1; Working Temperature Min: -40°С; Working Temperature Max: +125°С; Published: 21.02.2017; Publisher: Andrew Danich; Type: Супрессор; Part Number: USBLC6-2SC6; Value: USBLC6-2SC6; Functional Analog: -
L1 = BLM21PG331SN1: Manufacturer: Murata; Type: Дроссель; ID: 2; Rated Current: 1.5A; Impedance at 100Mhz: 330ohm; Tolerance: ±25%; DC Resistance: 0.07ohm; Inductor Type: EMIFIL; Application Category: 1; Working Temperature Min: -55°С; Working Temperature Max: +125°С; Published: 14.11.2014; Publisher: Andrew Danich; Part Number: BLM21PG331SN1; Value: BLM21PG331SN1; Footprint: 0805; ClassName: DirectConnect
R25 = RC0603JR-07100KL: Manufacturer: Yageo; ID: 11; Value: 100k; Limit Voltage: 50V; Tolerance: ±5%; Temperature Coefficient: 100ppm; Total Power Dissipation: 0.1W; Series Type: Thick-Film; Application Category: 1; Working Temperature Min: -55°С; Working Temperature Max: +155°С; Functional Analog: CR0603-JW-104E; Published: 24.03.2010; Publisher: Andrew Danich; Type: Резистор; Part Number: RC0603JR-07100KL; Footprint: 0603; ClassName: DirectConnect
R26 R27 = RC0603JR-07330RL: Manufacturer: Yageo; ID: 313; Value: 330; Limit Voltage: 50V; Tolerance: ±5%; Temperature Coefficient: 100ppm; Total Power Dissipation: 0.1W; Series Type: Thick-Film; Application Category: 1; Working Temperature Min: -55°С; Working Temperature Max: +155°С; Functional Analog: CR0603-JW-331E; Published: 24.03.2010; Publisher: Andrew Danich; Type: Резистор; Part Number: RC0603JR-07330RL; Footprint: 0603
R28-R31 = RC0603FR-0749R9L: Manufacturer: Yageo; ID: 249; Value: 49.9; Limit Voltage: 50V; Tolerance: ±1%; Temperature Coefficient: 100ppm; Total Power Dissipation: 0.1W; Series Type: Thick-Film; Application Category: 1; Working Temperature Min: -55°С; Working Temperature Max: +155°С; Functional Analog: CR0603-FX-49R9E; Published: 24.03.2010; Publisher: Andrew Danich; Type: Резистор; Part Number: RC0603FR-0749R9L; Footprint: 0603
R32 R33 = RC0603JR-071KL: as R2 on sheet 01_MAIN; Published: 24.03.2010; Publisher: Andrew Danich; Type: Резистор; Part Number: RC0603JR-071KL; Footprint: 0603
R34 = RC0603JR-074K7L: as R10 on sheet 01_MAIN; Published: 24.03.2010; Publisher: Andrew Danich; Type: Резистор; Part Number: RC0603JR-074K7L; Footprint: 0603
R35 R36 = RC0603JR-073KL: as R3 on sheet 01_MAIN; Published: 24.03.2010; Publisher: Andrew Danich; Type: Резистор; Part Number: RC0603JR-073KL; Footprint: 0603
R37 R38 = RC0603JR-070R: as R6 on sheet 01_MAIN; Published: 24.03.2010; Publisher: Andrew Danich; Type: Резистор; Part Number: RC0603JR-070R; Footprint: 0603
XP1 = PLS-12: Value: PLS-12; ID: 10; Limit Voltage: 250V; Limit Current: 3A; Connector Type: Male; Resistance: 15momh; Surface Finish: Gold; Pitch: 2.54mm; Application Category: 1; Published: 07.03.2013; Publisher: Andrew Danich; Type: Вилка; Part Number: PLS-12; Pins: 12
XP2 XP3 = PLS-6: Value: PLS-6; ID: 5; Limit Voltage: 250V; Limit Current: 3A; Connector Type: Male; Resistance: 15momh; Surface Finish: Gold; Pitch: 2.54mm; Application Category: 1; Published: 07.03.2013; Publisher: Andrew Danich; Type: Вилка; Part Number: PLS-6; Pins: 6
XS2 = 2041119-2: Manufacturer: TE Connectivity; ID: 2; Connector Type: Card Edge; Surface Finish: Gold; Pitch: 0.8mm; Application Category: 1; Published: 06.03.2019; Publisher: Andrew Danich; Type: Розетка; Part Number: 2041119-2; Value: 2041119-2; Pins: 52
XS3 = SK02-111006NL: Manufacturer: Sanken Electric Co., Ltd; ID: 18; Limit Voltage: 125V; Limit Current: 1.5A; Connector Type: Female; Interface: Ethernet/Int.Trans.; Max Data Rate: 10/100Mbs; Application Category: 1; Working Temperature Min: -40°С; Working Temperature Max: +70°С; Value: SK02-111006NL; Published: 08.09.2014; Publisher: Andrew Danich; Type: Розетка; Part Number: SK02-111006NL; Pins: 12; Mount Type: Through hole; Functional Analog: -
XS4 = A01SB141B1-067: Manufacturer: Jing Extension of the Electronic Co; ID: 37; Limit Voltage: 30V; Limit Current: 1A; Connector Type: Female; Interface: USB 2.0; Max Data Rate: 480 mbps; Application Category: 1; Published: 17.09.2018; Publisher: Andrew Danich; Type: Розетка; Part Number: A01SB141B1-067; Value: A01SB141B1-067; Pins: 5; Mount Type: Surface; ClassName: DirectConnect
XS5 = DS1095-B-R: Manufacturer: Connfly Electronic Co., Ltd; ID: 19; Limit Voltage: 30V; Limit Current: 1.5A; Connector Type: Female; Interface: USB 2.0; Max Data Rate: 480 mbps; Application Category: 1; Value: DS1095-B-R; Published: 07.03.2013; Publisher: Andrew Danich; Type: Розетка; Part Number: DS1095-B-R; Pins: 6; Mount Type: Through hole

## Sheet 03_I2S.SchDoc: =GlobalProjectName
size 594 x 420 mm; CheckedBy: A_D; Author: A_D; Organization: A_D Electronics; DocumentNumber: A_D.000000.001 Э3; Revision: 1; SheetNumber: 3; SheetTotal: 4; PageSetup: Record=PageOptions|CenterHorizontal=True|CenterVertical=True|PrintScale=0.70|XCorrection=1.00|YCorrection=1.00|PrintKind=2|BorderSize=5000000|LeftOffset=9000|BottomOffset=10100|Orientation=2|PaperLength=11176|PaperWidth=8636|Scale=100|PaperSource=259|PrintQuality=-3|MediaType=1|DitherType=10|PrintScaleMode=1|PaperKind=A3|PaperIndex=8; FirstApplication: A_D.000000.001; DocumentName: OM-O2S Dev.Board
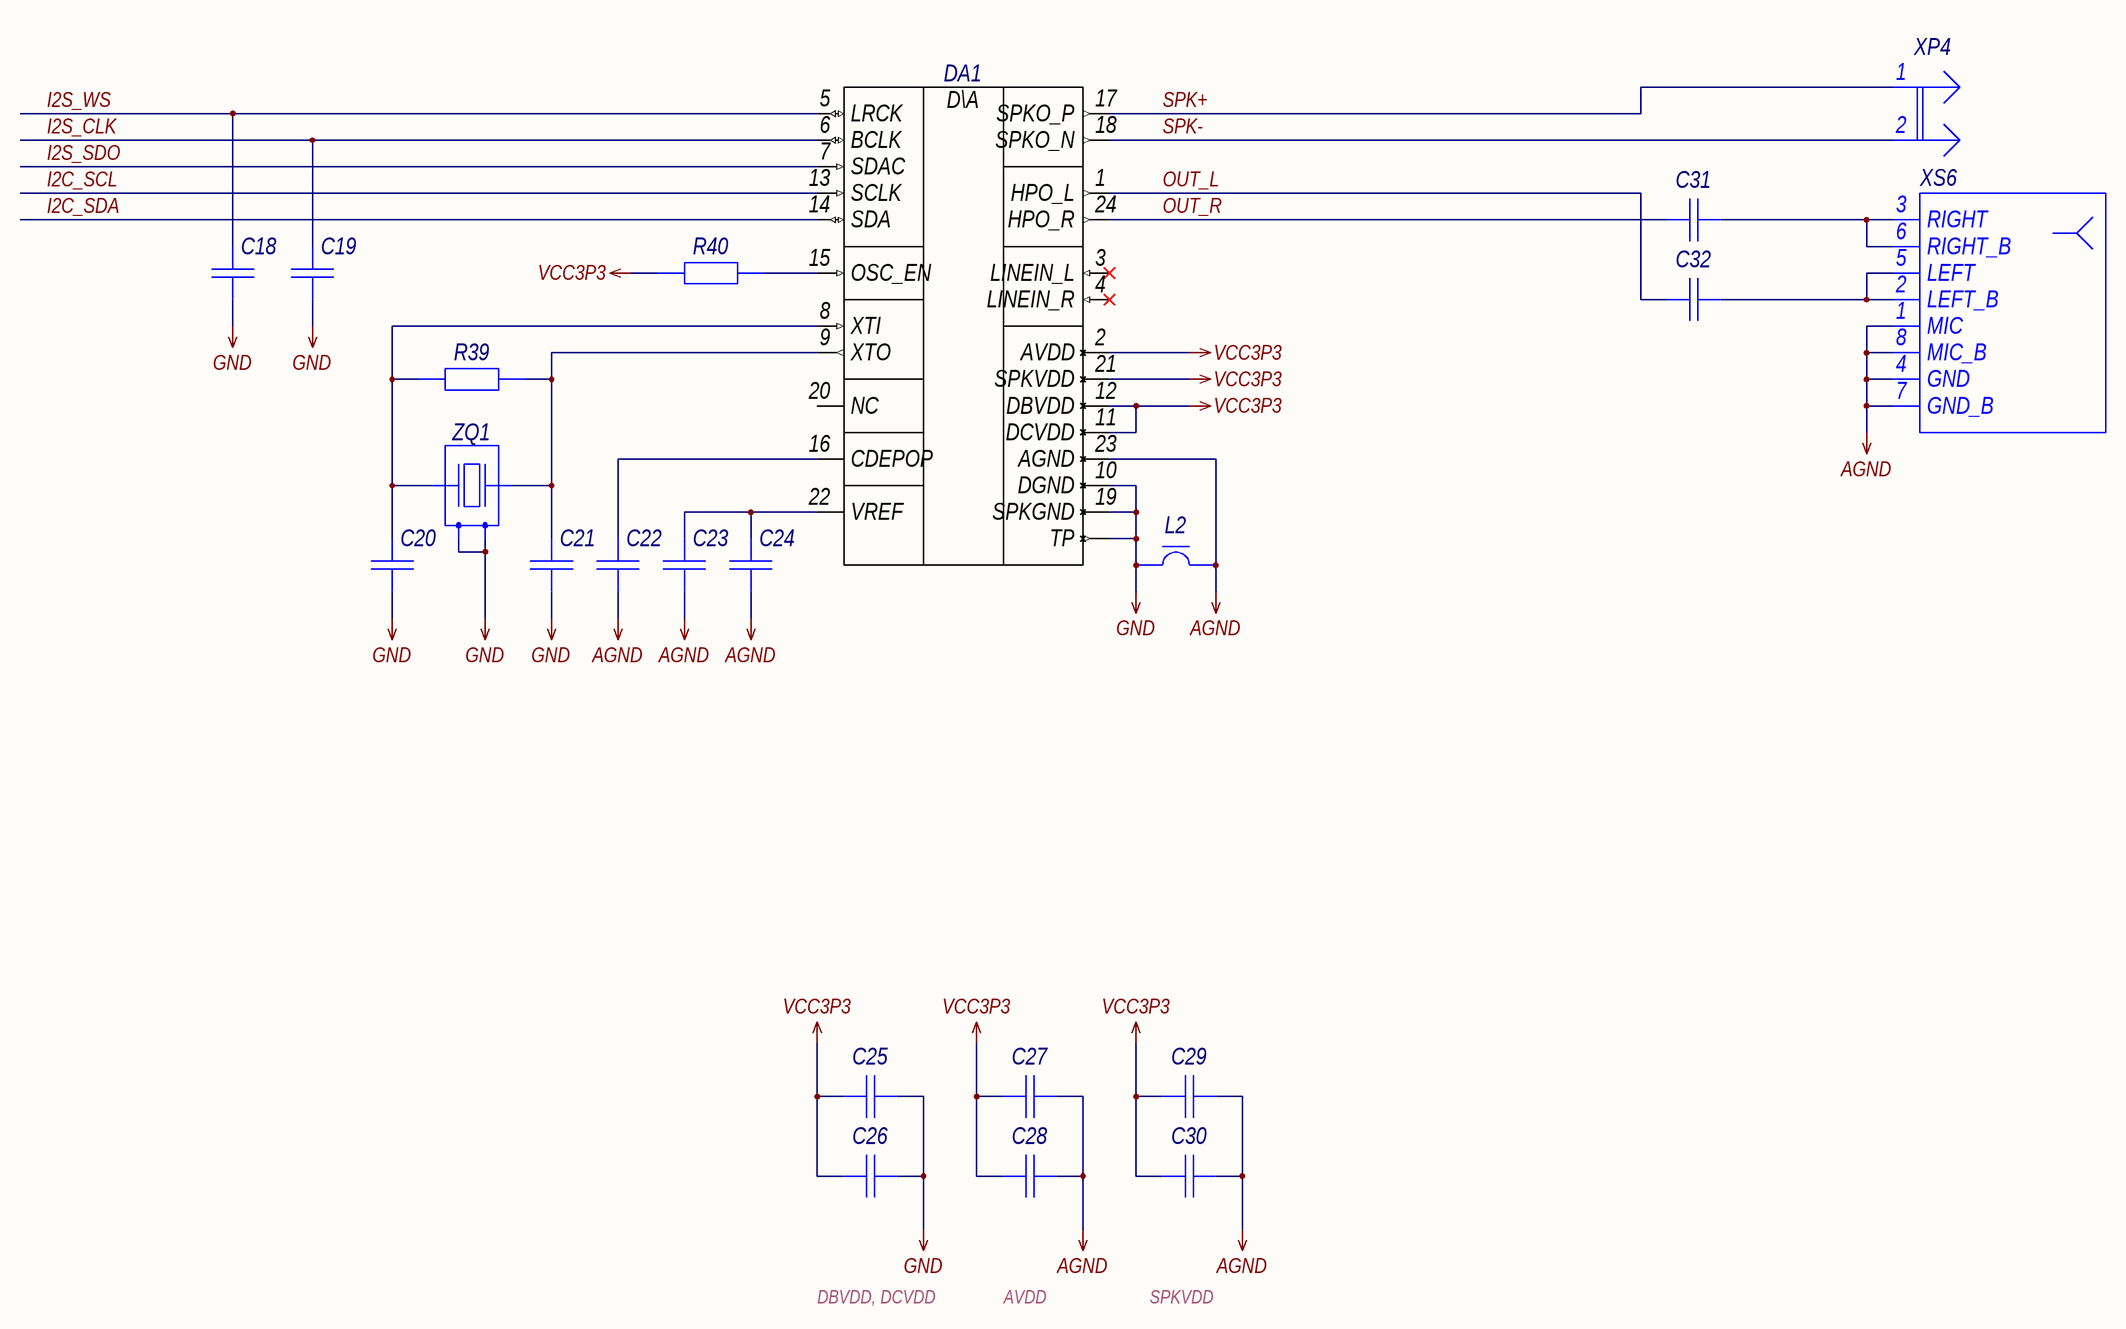
[diagram p2: 03_I2S.SchDoc]

### Parts
C18  Capacitor  [C0603_L]  (value not drawn)
C19  Capacitor  [C0603_L]  (value not drawn)
C20  Capacitor  [C0603_L]  (value not drawn)
C21  Capacitor  [C0603_L]  (value not drawn)
C22  Capacitor  [C0603_L]  (value not drawn)
C23  Capacitor  [C0603_L]  (value not drawn)
C24  Capacitor  [C0603_L]  (value not drawn)
C25  Capacitor  [C0603_L]  (value not drawn)
C26  Capacitor  [C0603_L]  (value not drawn)
C27  Capacitor  [C0603_L]  (value not drawn)
C28  Capacitor  [C0603_L]  (value not drawn)
C29  Capacitor  [C0603_L]  (value not drawn)
C30  Capacitor  [C0603_L]  (value not drawn)
C31  Capacitor  [C1210_L]  (value not drawn)
C32  Capacitor  [C1210_L]  (value not drawn)
DA1  ALC5628  [QFN-24_050P400X400X090_N]  (value not drawn)
L2  FerriteBead  [L0603_L]  (value not drawn)
R39  Resistor  [R0603_L]  (value not drawn)
R40  Resistor  [R0603_L]  (value not drawn)
XP4  SPK  [MW-2M]  (value not drawn)
XS6  OUT  [PJ30930-Series]  (value not drawn)
ZQ1  Crystal-1_3p_S  [SMD 3.2x2.5mm]  (value not drawn)

### Nets
AGND: C22.1 C23.1 C24.1 C27.2 C28.2 C29.2 C30.2 DA1.23(AGND) L2.2 XS6.1(MIC) XS6.4(GND) XS6.7(GND_B) XS6.8(MIC_B)
GND: C18.1 C19.1 C20.1 C21.1 C25.2 C26.2 DA1.10(DGND) DA1.19(SPKGND) DA1.TP L2.1 ZQ1.2 ZQ1.4
VCC3P3: C25.1 C26.1 C27.1 C28.1 C29.1 C30.1 DA1.2(AVDD) DA1.11(DCVDD) DA1.12(DBVDD) DA1.21(SPKVDD) R40.1
I2C_SCL: DA1.13(SCLK)
I2C_SDA: DA1.14(SDA)
I2S_CLK: C19.2 DA1.6(BCLK)
I2S_SDO: DA1.7(SDAC)
I2S_WS: C18.2 DA1.5(LRCK)
OUT_L: C32.1 DA1.1(HPO_L)
OUT_R: C31.1 DA1.24(HPO_R)
SPK+: DA1.17(SPKO_P) XP4.1
SPK-: DA1.18(SPKO_N) XP4.2
NetC20_2: C20.2 DA1.8(XTI) R39.1 ZQ1.1
NetC21_2: C21.2 DA1.9(XTO) R39.2 ZQ1.3
NetC22_2: C22.2 DA1.16(CDEPOP)
NetC23_2: C23.2 C24.2 DA1.22(VREF)
NetC31_2: C31.2 XS6.3(RIGHT) XS6.6(RIGHT_B)
NetC32_2: C32.2 XS6.2(LEFT_B) XS6.5(LEFT)
NetDA1_15: DA1.15(OSC_EN) R40.2

Not connected (* = marked no-connect by the designer): DA1 3(LINEIN_L)* 4(LINEIN_R)* 20(NC)

### Notes on the sheet
- DBVDD, DCVDD
- AVDD
- SPKVDD
- Подп. и дата
- Инв. № дубл.
- Взам. инв. №
- Инв. № подл.
- Изм.
- Лист
- № докум.
- Подп.
- Дата
- Форма 2а ГОСТ 2.104-2006
- Копировал
- Формат А2
- (in symbol ALC5628-GR) D\A

### Library data of the parts
C18 C19 = GRM1885C1H220JA01D: Manufacturer: Murata; Type: Конденсатор; ID: 122; Value: 22pF; Voltage: 50V; Tolerance: ±5%; Dielectric Type: NP0; Application Category: 1; Working Temperature Min: -55°С; Working Temperature Max: +125°С; Published: 18.05.2010; Publisher: Andrew Danich; Part Number: GRM1885C1H220JA01D; Footprint: 0603
C20 C21 = GCM1885C2A120JA16D: Manufacturer: Murata; Type: Конденсатор; ID: 121; Value: 12pF; Voltage: 100V; Tolerance: ±5%; Dielectric Type: NP0; Application Category: 1; Working Temperature Min: -55°С; Working Temperature Max: +125°С; Published: 18.05.2010; Publisher: Andrew Danich; Part Number: GCM1885C2A120JA16D; Footprint: 0603
C22 C25 C27 = GCM188R71E105KA64D: as C4 on sheet 01_MAIN; Published: 18.05.2010; Publisher: Andrew Danich; Part Number: GCM188R71E105KA64D; Footprint: 0603
C23 = GRM188R72A104KA35D: as C2 on sheet 01_MAIN; Published: 18.05.2010; Publisher: Andrew Danich; Part Number: GRM188R72A104KA35D; Footprint: 0603
C24 = GRT188C81E475KE13D: as C9 on sheet 01_MAIN; Published: 18.05.2010; Publisher: Andrew Danich; Part Number: GRT188C81E475KE13D; Footprint: 0603
C26 C28 C30 = GRM1885C2A102JA01D: Manufacturer: Murata; Type: Конденсатор; ID: 135; Value: 1000pF; Voltage: 100V; Tolerance: ±5%; Dielectric Type: NP0; Application Category: 1; Working Temperature Min: -55°С; Working Temperature Max: +125°С; Published: 18.05.2010; Publisher: Andrew Danich; Part Number: GRM1885C2A102JA01D; Footprint: 0603
C29 = GRM188R61A106KE69D: as C1 on sheet 01_MAIN; Published: 18.05.2010; Publisher: Andrew Danich; Part Number: GRM188R61A106KE69D; Footprint: 0603
C31 C32 = GRM32ER60J107ME20L: Manufacturer: Murata; Type: Конденсатор; ID: 174; Value: 100uF; Voltage: 6.3V; Tolerance: ±20%; Dielectric Type: X5R; Application Category: 1; Working Temperature Min: -55°С; Working Temperature Max: +85°С; Published: 18.05.2010; Publisher: Andrew Danich; Part Number: GRM32ER60J107ME20L; Footprint: 1210
DA1 = ALC5628-GR: Manufacturer: Realtek; ID: 8; Supply Operation: +2.3…3.6V; Channel: 2; THD: -86dB; Interface: I2S/PCM; Application Category: 1; Working Temperature Min: -20°С; Working Temperature Max: +85°С; Functional Analog: ALC5628-GRT; Type: Микросхема; Published: 06.09.2018; Publisher: Andrew Danich; Part Number: ALC5628-GR; Value: ALC5628-GR
L2 = BLM18PG121SN1: Manufacturer: Murata; Type: Дроссель; ID: 4; Rated Current: 2A; Impedance at 100Mhz: 120ohm; DC Resistance: 0.05ohm; Inductor Type: EMIFIL; Application Category: 1; Working Temperature Min: -55°С; Working Temperature Max: +125°С; Published: 14.11.2014; Publisher: Andrew Danich; Part Number: BLM18PG121SN1; Value: BLM18PG121SN1; Footprint: 0603; ClassName: DirectConnect
R39 = RC0603JR-071ML: Manufacturer: Yageo; ID: 20; Value: 1meg; Limit Voltage: 50V; Tolerance: ±5%; Temperature Coefficient: 100ppm; Total Power Dissipation: 0.1W; Series Type: Thick-Film; Application Category: 1; Working Temperature Min: -55°С; Working Temperature Max: +155°С; Published: 24.03.2010; Publisher: Andrew Danich; Type: Резистор; Part Number: RC0603JR-071ML; Footprint: 0603
R40 = RC0603JR-070R: as R6 on sheet 01_MAIN; Published: 24.03.2010; Publisher: Andrew Danich; Type: Резистор; Part Number: RC0603JR-070R; Footprint: 0603
XP4 = MW-2M: Value: MW-2M; ID: 60; Limit Voltage: 100V; Limit Current: 2A; Connector Type: Male; Resistance: 20mohm; Surface Finish: Phosphor Bronze; Pitch: 2mm; Application Category: 1; Published: 07.03.2013; Publisher: Andrew Danich; Type: Вилка; Part Number: MW-2M; Pins: 2
XS6 = PJ30930-Q-LC0AG00TR-7260: Manufacturer: Dongnan Electronics; ID: 11; Limit Voltage: 30V; Limit Current: 0.5A; Connector Type: Female; Standart: 3.5 mm; Application Category: 1; Working Temperature Min: -25°С; Working Temperature Max: +85°С; Functional Analog: PJ30930-Q-LC0AG00-7260; Value: PJ30930-Q-LC0AG00TR-7260; Published: 06.09.2018; Publisher: Andrew Danich; Type: Розетка; Part Number: PJ30930-Q-LC0AG00TR-7260; Pins: 8; Mount Type: Surface
ZQ1 = MCSJK-7U-24.576-12-30-60-B-30: Manufacturer: Multicomp; ID: 27; Output Frequency: 24.576МГц; Load Capacitance: 12pF; Temperature Coefficient: ±30ppm; Application Category: 1; Working Temperature Min: -20°С; Working Temperature Max: +70°С; Published: 06.09.2018; Publisher: Andrew Danich; Type: Резонатор; Part Number: MCSJK-7U-24.576-12-30-60-B-30; Value: MCSJK-7U-24.576-12-30-60-B-30; Functional Analog: -

## Sheet 04_Power.SchDoc: =GlobalProjectName
size 594 x 420 mm; CheckedBy: A_D; Author: A_D; Organization: A_D Electronics; DocumentNumber: A_D.000000.001 Э3; Revision: 1; SheetNumber: 4; SheetTotal: 4; PageSetup: Record=PageOptions|CenterHorizontal=True|CenterVertical=True|PrintScale=0.70|XCorrection=1.00|YCorrection=1.00|PrintKind=2|BorderSize=5000000|LeftOffset=9000|BottomOffset=10100|Orientation=2|PaperLength=11176|PaperWidth=8636|Scale=100|PaperSource=259|PrintQuality=-3|MediaType=1|DitherType=10|PrintScaleMode=1|PaperKind=A3|PaperIndex=8; FirstApplication: A_D.000000.001; DocumentName: OM-O2S Dev.Board
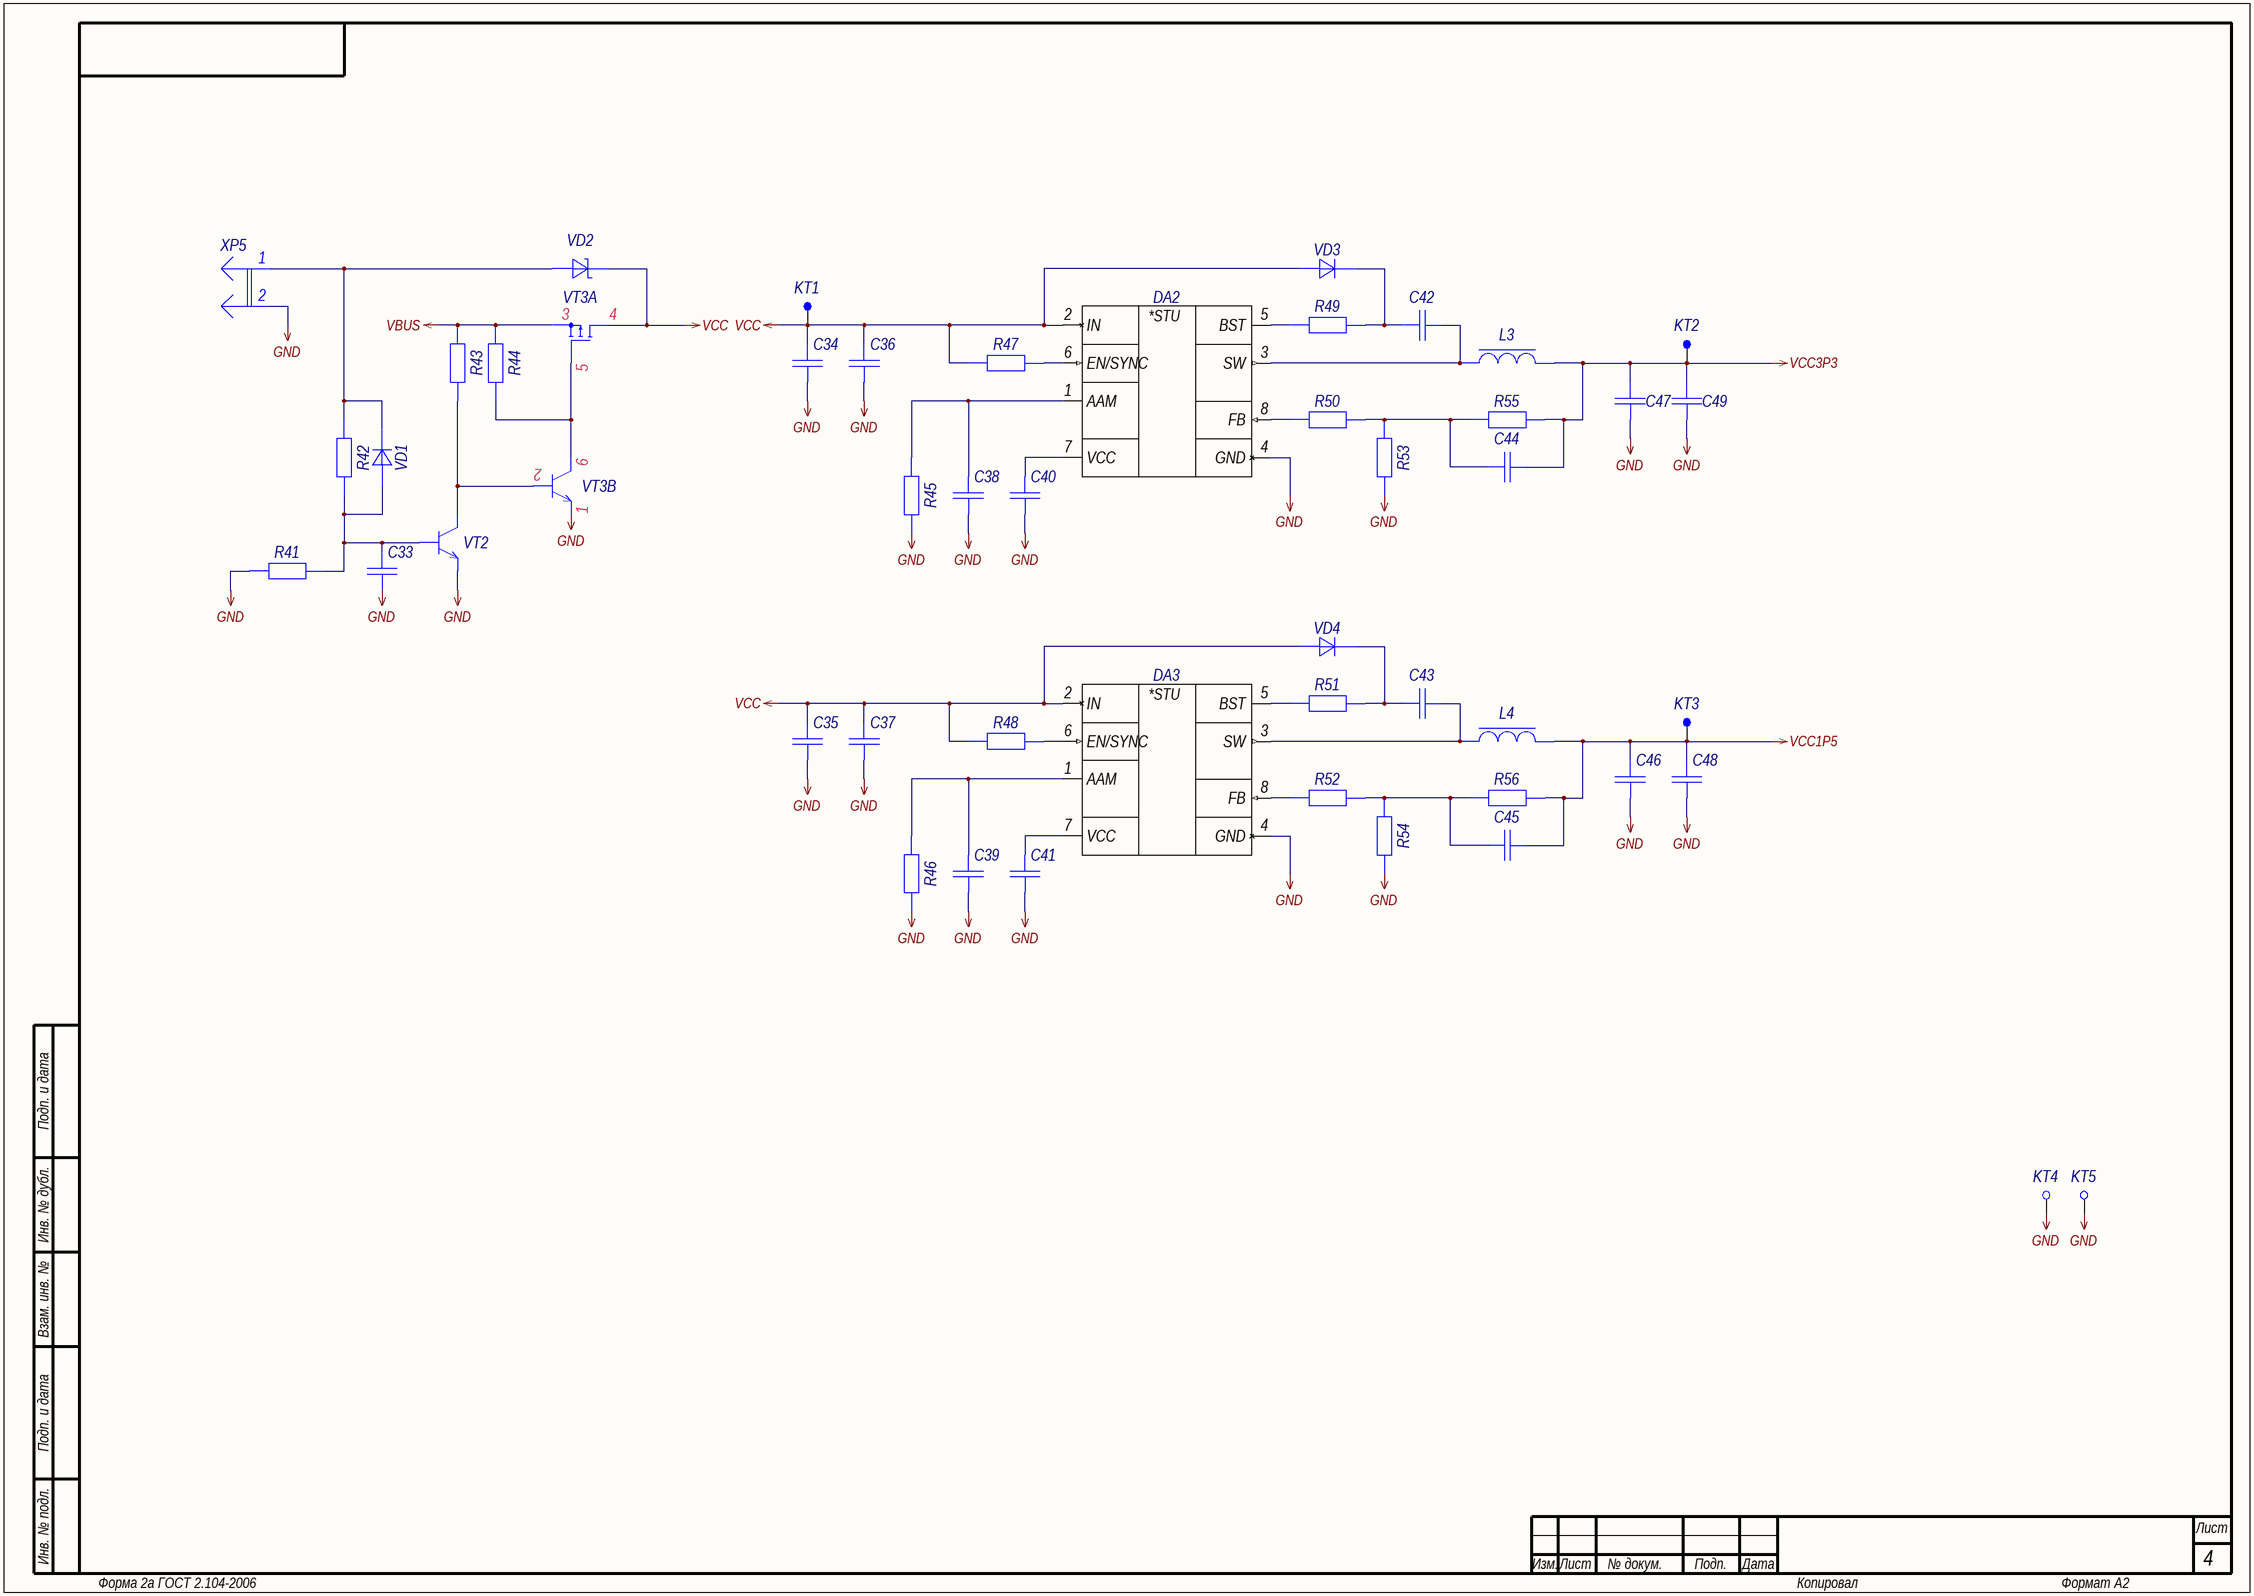
[diagram p3: 04_Power.SchDoc]

### Parts
C33  Capacitor  [C0603_L]  (value not drawn)
C34  Capacitor  [C1206_L]  (value not drawn)
C35  Capacitor  [C1206_L]  (value not drawn)
C36  Capacitor  [C0603_L]  (value not drawn)
C37  Capacitor  [C0603_L]  (value not drawn)
C38  Capacitor  [C0603_L]  (value not drawn)
C39  Capacitor  [C0603_L]  (value not drawn)
C40  Capacitor  [C0603_L]  (value not drawn)
C41  Capacitor  [C0603_L]  (value not drawn)
C42  Capacitor  [C0603_L]  (value not drawn)
C43  Capacitor  [C0603_L]  (value not drawn)
C44  Capacitor  [C0603_L]  (value not drawn)
C45  Capacitor  [C0603_L]  (value not drawn)
C46  Capacitor  [C0805_L]  (value not drawn)
C47  Capacitor  [C0805_L]  (value not drawn)
C48  Capacitor  [C0805_L]  (value not drawn)
C49  Capacitor  [C0805_L]  (value not drawn)
DA2  MP2315GJ  [TSOT-23-8_065P290X160X100_N]  (value not drawn)
DA3  MP2315GJ  [TSOT-23-8_065P290X160X100_N]  (value not drawn)
KT1  VCC  [TP-SMT-C-0.8mm]  (value not drawn)  (no BOM)
KT2  +3.3В  [TP-SMT-C-0.8mm]  (value not drawn)  (no BOM)
KT3  +1.5V  [TP-SMT-C-0.8mm]  (value not drawn)  (no BOM)
KT4  ОБЩ  [5001]  (value not drawn)  (no BOM)
KT5  ОБЩ  [5001]  (value not drawn)  (no BOM)
L3  Coil  [SRP4020TA-Series]  (value not drawn)
L4  Coil  [SRP4020TA-Series]  (value not drawn)
R41  Resistor  [R0603_L]  (value not drawn)
R42  Resistor  [R0603_L]  (value not drawn)
R43  Resistor  [R0603_L]  (value not drawn)
R44  Resistor  [R0603_L]  (value not drawn)
R45  Resistor  [R0603_L]  (value not drawn)
R46  Resistor  [R0603_L]  (value not drawn)
R47  Resistor  [R0603_L]  (value not drawn)
R48  Resistor  [R0603_L]  (value not drawn)
R49  Resistor  [R0603_L]  (value not drawn)
R50  Resistor  [R0603_L]  (value not drawn)
R51  Resistor  [R0603_L]  (value not drawn)
R52  Resistor  [R0603_L]  (value not drawn)
R53  Resistor  [R0603_L]  (value not drawn)
R54  Resistor  [R0603_L]  (value not drawn)
R55  Resistor  [R0603_L]  (value not drawn)
R56  Resistor  [R0603_L]  (value not drawn)
VD1  Diode  [SOD-323]  (value not drawn)
VD2  Schottky  [SOD-123]  (value not drawn)
VD3  Diode  [SOD-323]  (value not drawn)
VD4  Diode  [SOD-323]  (value not drawn)
VT2  BJT-NPN  [SOT-23_190P290X160X145_N]  (value not drawn)
VT3  PMC85XP  [SOT-1118-2M_065P200X200X065_N]  (value not drawn)  (parts A,B of 2)
XP5  VCC  [MW-2M]  (value not drawn)

### Nets
GND: C33.1 C34.1 C35.1 C36.1 C37.1 C38.1 C39.1 C40.1 C41.1 C46.1 C47.1 C48.1 C49.1 DA2.4(GND) DA3.4(GND) KT4.1 KT5.1 R41.2 R45.1 R46.1 R53.1 R54.1 VT2.3(Э) VT3.1(Э) XP5.2
VBUS: R43.2 R44.2 VT3.3(S)
VCC: C34.2 C35.2 C36.2 C37.2 DA2.2(IN) DA3.2(IN) KT1.1 R47.1 R48.1 VD2.2(К) VD3.1(А) VD4.1(А) VT3.4(D)
VCC1P5: C45.2 C46.2 C48.2 KT3.1 L4.2 R56.2
VCC3P3: C44.2 C47.2 C49.2 KT2.1 L3.2 R55.2
NetC33_2: C33.2 R41.1 R42.1 VD1.1(А) VT2.1(Б)
NetC38_2: C38.2 DA2.1(AAM) R45.2
NetC39_2: C39.2 DA3.1(AAM) R46.2
NetC40_2: C40.2 DA2.7(VCC)
NetC41_2: C41.2 DA3.7(VCC)
NetC42_1: C42.1 R49.2 VD3.2(К)
NetC42_2: C42.2 DA2.3(SW) L3.1
NetC43_1: C43.1 R51.2 VD4.2(К)
NetC43_2: C43.2 DA3.3(SW) L4.1
NetC44_1: C44.1 R50.2 R53.2 R55.1
NetC45_1: C45.1 R52.2 R54.2 R56.1
NetDA2_5: DA2.5(BST) R49.1
NetDA2_6: DA2.6(EN/SYNC) R47.2
NetDA2_8: DA2.8(FB) R50.1
NetDA3_5: DA3.5(BST) R51.1
NetDA3_6: DA3.6(EN/SYNC) R48.2
NetDA3_8: DA3.8(FB) R52.1
NetR42_2: R42.2 VD1.2(К) VD2.1(А) XP5.1
NetR43_1: R43.1 VT2.2(К) VT3.2(Б)
NetR44_1: R44.1 VT3.5(G) VT3.6(К)

### Notes on the sheet
- Подп. и дата
- Инв. № дубл.
- Взам. инв. №
- Инв. № подл.
- Изм.
- Лист
- № докум.
- Подп.
- Дата
- Форма 2а ГОСТ 2.104-2006
- Копировал
- Формат А2
- (in symbol MP2315GJ-Z) *STU

### Library data of the parts
C33 C36 C37 C40-C43 = GRM188R72A104KA35D: as C2 on sheet 01_MAIN; Published: 18.05.2010; Publisher: Andrew Danich; Part Number: GRM188R72A104KA35D; Footprint: 0603
  C36 C37 C42 C43: ClassName: DirectConnect
C34 C35 = GRM31CR71A226KE15L: Manufacturer: Murata; Type: Конденсатор; ID: 238; Value: 22uF; Voltage: 10V; Tolerance: ±10%; Dielectric Type: X7R; Application Category: 1; Working Temperature Min: -55°С; Working Temperature Max: +125°С; Published: 18.05.2010; Publisher: Andrew Danich; Part Number: GRM31CR71A226KE15L; Footprint: 1206; ClassName: DirectConnect
C38 C39 = GRM1885C2A102JA01D: as C26 on sheet 03_I2S; Published: 18.05.2010; Publisher: Andrew Danich; Part Number: GRM1885C2A102JA01D; Footprint: 0603
C44 C45 = GRM1885C1H330JA01D: Manufacturer: Murata; Type: Конденсатор; ID: 123; Value: 33pF; Voltage: 50V; Tolerance: ±5%; Dielectric Type: NP0; Application Category: 1; Working Temperature Min: -55°С; Working Temperature Max: +125°С; Published: 18.05.2010; Publisher: Andrew Danich; Part Number: GRM1885C1H330JA01D; Footprint: 0603
C46-C49 = GRM21BR60J226ME39L: Manufacturer: Murata; Type: Конденсатор; ID: 140; Value: 22uF; Voltage: 6.3V; Tolerance: ±20%; Dielectric Type: X5R; Application Category: 1; Working Temperature Min: -55°С; Working Temperature Max: +85°С; Published: 18.05.2010; Publisher: Andrew Danich; Part Number: GRM21BR60J226ME39L; Footprint: 0805; ClassName: DirectConnect
DA2 DA3 = MP2315GJ-Z: Manufacturer: Monolithic Power Systems; ID: 38; Input Voltage: +4.5…24V; Output Current: 3A; Output Voltage: +0.8…22.8V; Shutdown Input: YES; Frequency: 500kHz; Application Category: 1; Working Temperature Min: -40°С; Working Temperature Max: +125°С; Functional Analog: MP2315GJ-P; Type: Микросхема; Published: 01.09.2018; Publisher: Andrew Danich; Part Number: MP2315GJ-Z; Value: MP2315GJ-Z; ClassName: DirectConnect
KT1-KT3 = TestPoint-SMT: ID: 6; Application Type: On PCB Test Point; Application Category: 1; Published: 03.03.2015; Publisher: Andrew Danich; Part Number: TestPoint-SMT; Value: TestPoint-SMT; Manufacturer: -; Functional Analog: -
KT4 KT5 = 5001: Manufacturer: Keystone Electronics; ID: 2; Value: 5001; Limit Voltage: 100V; Rated Current: 0.5A; Application Type: Miniature THM Test Point; Application Category: 1; Published: 03.03.2015; Publisher: Andrew Danich; Part Number: 5001; Functional Analog: -
L3 L4 = SRP4020TA-4R7M: Manufacturer: Bourns; Type: Дроссель; ID: 103; Rated Current: 2.6A; Tolerance: ±20%; Inductance: 4.7uH; Q: 10; DC Resistance: 0.105ohm; Self-Resonant Frequency: 27MHz; Application Category: 1; Working Temperature Min: -40°С; Working Temperature Max: +125°С; Published: 20.05.2010; Publisher: Andrew Danich; Part Number: SRP4020TA-4R7M; Value: SRP4020TA-4R7M; Footprint: SRP4020TA; ClassName: DirectConnect
R41-R44 = RC0603JR-0710KL: as R5 on sheet 01_MAIN; Published: 24.03.2010; Publisher: Andrew Danich; Type: Резистор; Part Number: RC0603JR-0710KL; Footprint: 0603
R45 R46 = RC0603JR-0762KL: Manufacturer: Yageo; ID: 74; Value: 62k; Limit Voltage: 50V; Tolerance: ±5%; Temperature Coefficient: 100ppm; Total Power Dissipation: 0.1W; Series Type: Thick-Film; Application Category: 1; Working Temperature Min: -55°С; Working Temperature Max: +155°С; Published: 24.03.2010; Publisher: Andrew Danich; Type: Резистор; Part Number: RC0603JR-0762KL; Footprint: 0603
R47 R48 = RC0603JR-07100KL: as R25 on sheet 02_PCIE; Published: 24.03.2010; Publisher: Andrew Danich; Type: Резистор; Part Number: RC0603JR-07100KL; Footprint: 0603
R49 R51 = RC0603JR-0722RL: as R15 on sheet 01_MAIN; Published: 24.03.2010; Publisher: Andrew Danich; Type: Резистор; Part Number: RC0603JR-0722RL; Footprint: 0603
R50 R52 = RC0603JR-0733KL: Manufacturer: Yageo; ID: 47; Value: 33k; Limit Voltage: 50V; Tolerance: ±5%; Temperature Coefficient: 100ppm; Total Power Dissipation: 0.1W; Series Type: Thick-Film; Application Category: 1; Working Temperature Min: -55°С; Working Temperature Max: +155°С; Published: 24.03.2010; Publisher: Andrew Danich; Type: Резистор; Part Number: RC0603JR-0733KL; Footprint: 0603
R53 = RC0603FR-0712K7L: Manufacturer: Yageo; ID: 263; Value: 12.7k; Limit Voltage: 50V; Tolerance: ±1%; Temperature Coefficient: 100ppm; Total Power Dissipation: 0.1W; Series Type: Thick-Film; Application Category: 1; Working Temperature Min: -55°С; Working Temperature Max: +155°С; Published: 24.03.2010; Publisher: Andrew Danich; Type: Резистор; Part Number: RC0603FR-0712K7L; Footprint: 0603
R54 = RC0603FR-0746K4L: Manufacturer: Yageo; ID: 298; Value: 46.4k; Limit Voltage: 50V; Tolerance: ±1%; Temperature Coefficient: 100ppm; Total Power Dissipation: 0.1W; Series Type: Thick-Film; Application Category: 1; Working Temperature Min: -55°С; Working Temperature Max: +155°С; Published: 24.03.2010; Publisher: Andrew Danich; Type: Резистор; Part Number: RC0603FR-0746K4L; Footprint: 0603
R55 R56 = RC0603FR-0740K2L: Manufacturer: Yageo; ID: 294; Value: 40.2k; Limit Voltage: 50V; Tolerance: ±1%; Temperature Coefficient: 100ppm; Total Power Dissipation: 0.1W; Series Type: Thick-Film; Application Category: 1; Working Temperature Min: -55°С; Working Temperature Max: +155°С; Published: 24.03.2010; Publisher: Andrew Danich; Type: Резистор; Part Number: RC0603FR-0740K2L; Footprint: 0603
VD1 VD3 VD4 = 1N4148WS-7-F: Manufacturer: Diodes Incorporated; Type: Диод; ID: 13; Reverse Voltage: 100V; Reverse Current: 1uA; Forward Voltage: 1V; Forward Current: 150mA; Total Power Dissipation: 200mW; Capacitance: 2pF; Recovery Time: 4nS; Application Category: 1; Working Temperature Min: -55°С; Working Temperature Max: +150°С; Published: 18.05.2010; Publisher: Andrew Danich; Part Number: 1N4148WS-7-F; Value: 1N4148WS-7-F; Functional Analog: 1N4148WS
VD2 = MBR0540T1G: Manufacturer: ON Semiconductor; Type: Диод; ID: 11; Reverse Voltage: 40V; Reverse Current: 250uA; Forward Voltage: 0.51V; Forward Current: 0.5A; Total Power Dissipation: 410mW; Capacitance: 170pF; Application Category: 1; Working Temperature Min: -55°С; Working Temperature Max: +150°С; Published: 18.05.2010; Publisher: Andrew Danich; Part Number: MBR0540T1G; Value: MBR0540T1G; Functional Analog: MBR0540; ClassName: DirectConnect
VT2 = BC846: Part Number: BC846; Type: Транзистор; ID: 9; Value: BC846; C-E Voltage: 65V; Collector Current: 100mA; C-E Saturation Voltage: 0.6V; DC Current Gain: 110…450; Total Power Dissipation: 250mW; Transition Frequency: 100MHz; Application Category: 1; Published: 07.05.2013; Publisher: Andrew Danich
VT3 = PMC85XP: as VT1 on sheet 01_MAIN; Published: 13.03.2017; Publisher: Andrew Danich; Part Number: PMC85XP; Value: PMC85XP; Functional Analog: -; ClassName: DirectConnect
XP5 = MW-2M: as XP4 on sheet 03_I2S; Published: 07.03.2013; Publisher: Andrew Danich; Type: Вилка; Part Number: MW-2M; Pins: 2

## Nets that join several sheets
GND: 01_MAIN (40 pins), 02_PCIE (39 pins), 03_I2S (12 pins), 04_Power (25 pins)
VBUS: 02_PCIE (DD1.8 L1.2 R38.2), 04_Power (R43.2 R44.2 VT3.3)
VCC: 02_PCIE (R37.2 XP3.1), 04_Power (13 pins)
VCC1P5: 02_PCIE (XS2.6 XS2.28 XS2.48), 04_Power (6 pins)
VCC3P3: 01_MAIN (32 pins), 02_PCIE (15 pins), 03_I2S (11 pins), 04_Power (6 pins)
ETH_DATA: 01_MAIN (A1.6), 02_PCIE (R26.1)
ETH_LINK: 01_MAIN (A1.7), 02_PCIE (R27.1)
ETH_RX_N: 01_MAIN (A1.42), 02_PCIE (R28.2 XS3.8)
ETH_RX_P: 01_MAIN (A1.41), 02_PCIE (R29.2 XS3.7)
ETH_TX_N: 01_MAIN (A1.44), 02_PCIE (R30.2 XS3.2)
ETH_TX_P: 01_MAIN (A1.43), 02_PCIE (R31.2 XS3.1)
GPIO14: 01_MAIN (A1.45), 02_PCIE (XP1.1)
GPIO36: 01_MAIN (A1.3), 02_PCIE (XP1.11)
I2C_SCL: 01_MAIN (A1.30 HG1.18 R11.2), 02_PCIE (XP1.8 XS2.30), 03_I2S (DA1.13)
I2C_SDA: 01_MAIN (A1.31 HG1.19 HG1.20 R12.2), 02_PCIE (XP1.7 XS2.32), 03_I2S (DA1.14)
I2S_CLK: 01_MAIN (A1.29), 03_I2S (C19.2 DA1.6)
I2S_SDO: 01_MAIN (A1.27), 03_I2S (DA1.7)
I2S_WS: 01_MAIN (A1.28), 03_I2S (C18.2 DA1.5)
PCIE_CLK_N: 01_MAIN (A1.14), 02_PCIE (XS2.11)
PCIE_CLK_P: 01_MAIN (A1.15), 02_PCIE (XS2.13)
PCIE_PERST_N: 01_MAIN (A1.2), 02_PCIE (XS2.22)
PCIE_RESET_N: 01_MAIN (R17.1), 02_PCIE (XS2.20)
PCIE_RX0_N: 01_MAIN (A1.13), 02_PCIE (XS2.23)
PCIE_RX0_P: 01_MAIN (A1.12), 02_PCIE (XS2.25)
PCIE_TX0_N: 01_MAIN (A1.10), 02_PCIE (XS2.31)
PCIE_TX0_P: 01_MAIN (A1.11), 02_PCIE (XS2.33)
PWM_CH0: 01_MAIN (A1.49), 02_PCIE (XP2.2)
PWM_CH1: 01_MAIN (A1.50), 02_PCIE (XP2.3)
PWM_CH2: 01_MAIN (A1.51), 02_PCIE (XP2.4)
PWM_CH3: 01_MAIN (A1.52), 02_PCIE (XP2.5)
SPI_CLK: 01_MAIN (A1.34), 02_PCIE (XP1.6 XS2.45)
SPI_CS0: 01_MAIN (A1.37), 02_PCIE (XP1.2 XS2.51)
SPI_CS1: 01_MAIN (A1.33), 02_PCIE (XP1.3)
SPI_MISO: 01_MAIN (A1.35), 02_PCIE (XP1.5 XS2.47)
SPI_MOSI: 01_MAIN (A1.36), 02_PCIE (XP1.4 XS2.49)
UART1_RXD: 01_MAIN (A1.21), 02_PCIE (XP1.9)
UART1_TXD: 01_MAIN (A1.20), 02_PCIE (XP1.10)
UART_RXD: 01_MAIN (A1.40), 02_PCIE (R32.2 R36.2)
UART_TXD: 01_MAIN (A1.39), 02_PCIE (R33.2 R35.2)
USBH_N: 01_MAIN (R16.1), 02_PCIE (FV1.6 XS2.36)
USBH_P: 01_MAIN (R15.1), 02_PCIE (FV1.4 XS2.38)
WLED_N: 01_MAIN (A1.19 R2.2), 02_PCIE (XS2.42)